# Altium project SmartHaloEE.PrjPcb (part 1 of 2)
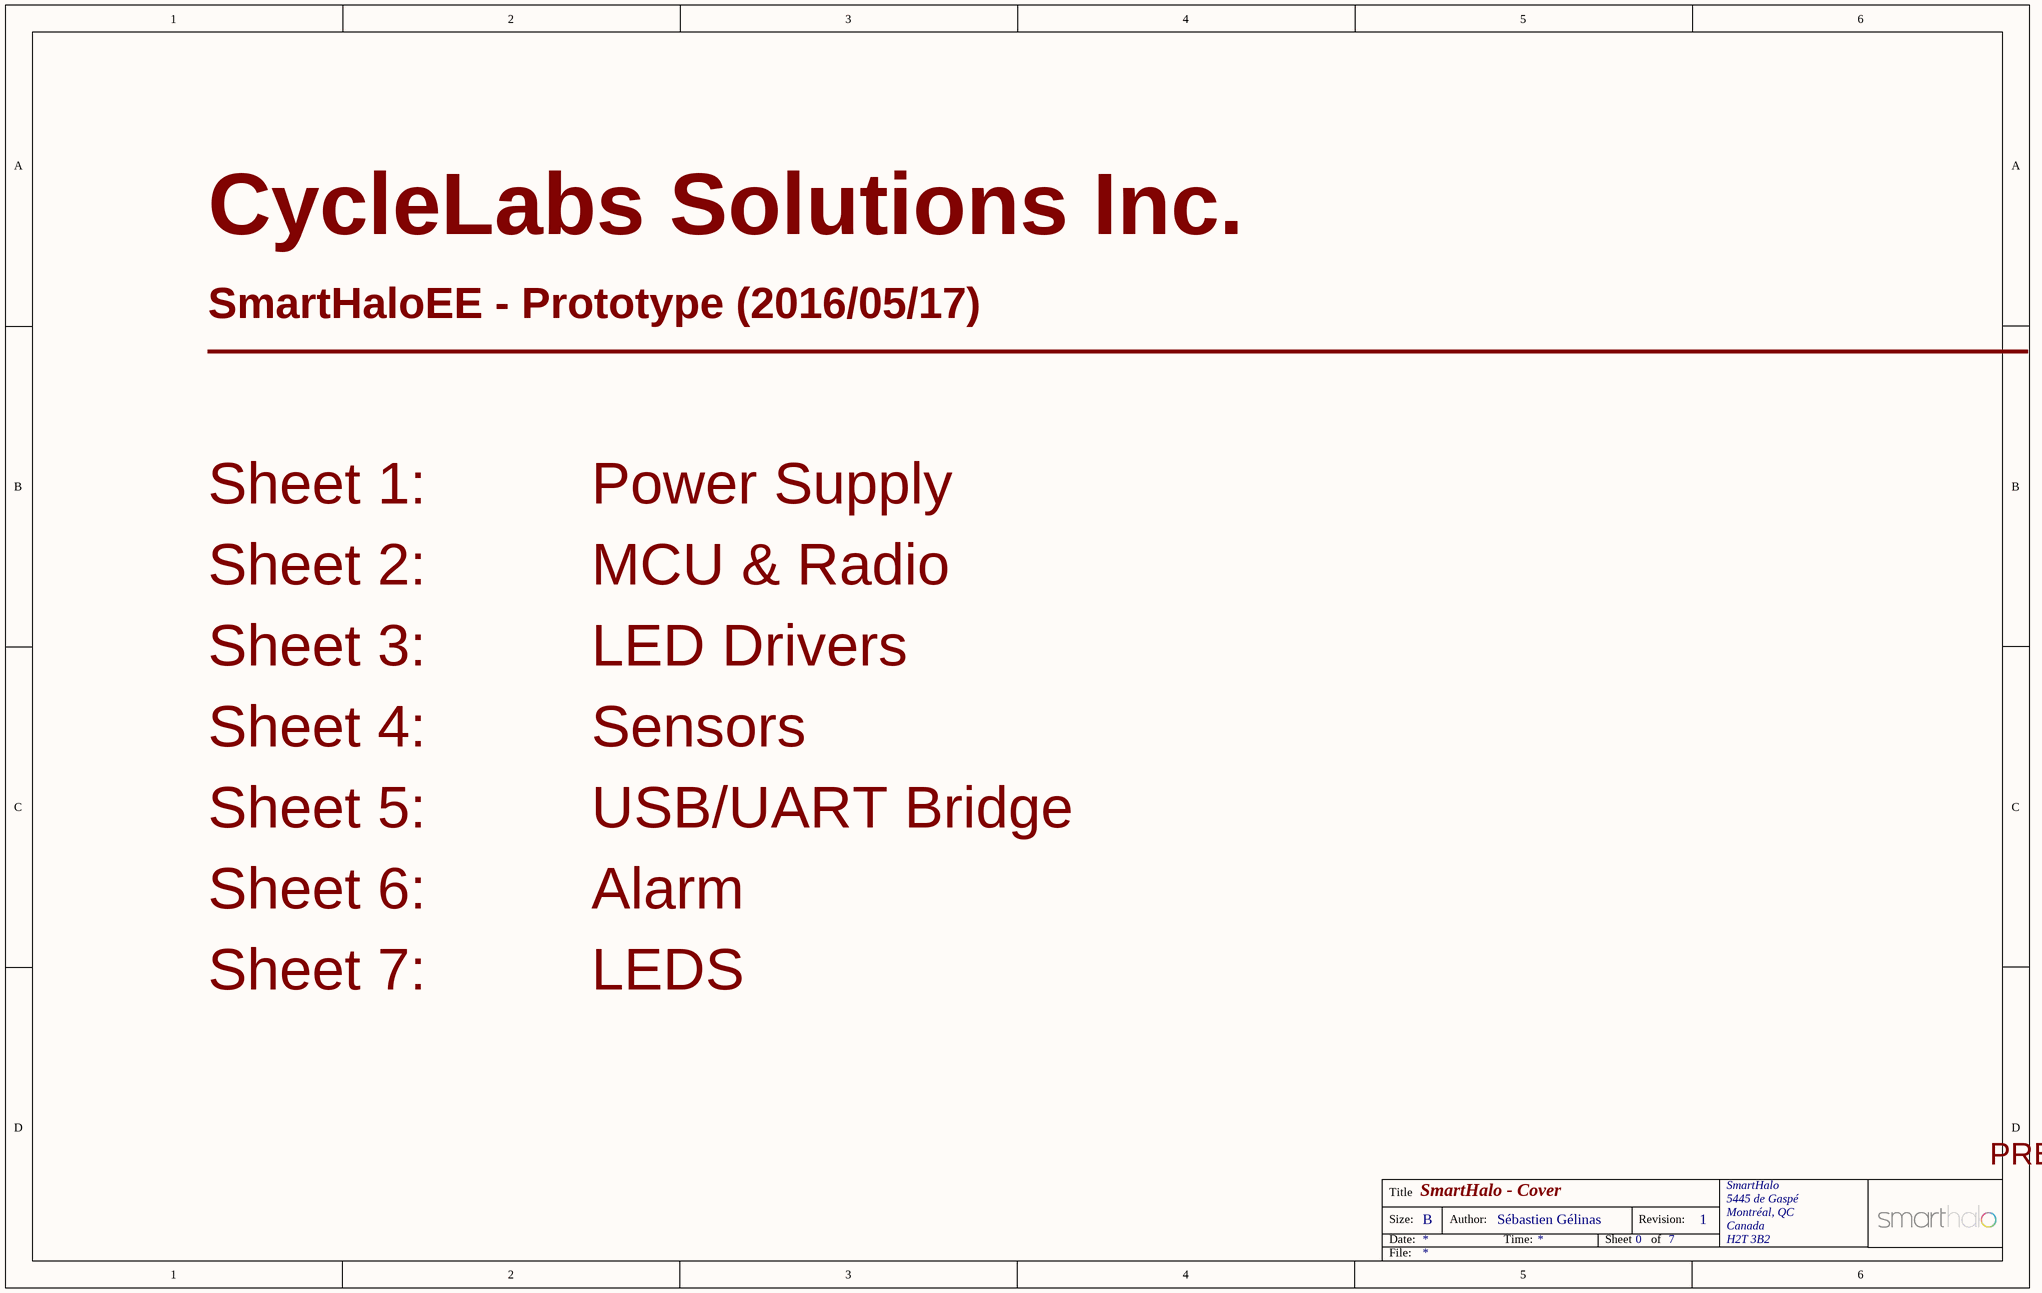
[diagram p0: 0_COVER.SchDoc]
ApprovedBy: Olivier Bourbonnais
8 sheets, 314 parts. Net scope: flat (ports and power ports of the same name join across sheets).
Board file: SmartHaloEE.PcbDoc
Sheets:
  0_COVER.SchDoc
  1_PWR.SchDoc
  2_BLE.SchDoc
  3_LEDDRIVERS.SchDoc
  4_SENSORS.SchDoc
  5_MISC.SchDoc
  6_ALARM.SchDoc
  7_LEDS.SchDoc

## Sheet 0_COVER.SchDoc: SmartHalo - Cover
size B; Author: Sébastien Gélinas; Organization: SmartHalo; Address1: 5445 de Gaspé; Address2: Montréal, QC; Address3: Canada; Address4: H2T 3B2; DocumentNumber: 1; Revision: 1; SheetNumber: 0; SheetTotal: 7

### Notes on the sheet
- CycleLabs Solutions Inc.
- SmartHaloEE - Prototype (2016/05/17)
- ________________________________________________________
- Sheet 1:          Power Supply
- Sheet 2:          MCU & Radio
- Sheet 3:          LED Drivers
- Sheet 4:          Sensors
- Sheet 5:          USB/UART Bridge
- Sheet 6:          Alarm
- Sheet 7:          LEDS
- PRELIMINARY: DO NOT USE FOR PRODUCTION
- Title
- Size:
- Date:
- B
- Author:
- Time:
- Sheet
- Revision:
- of
- File:

## Sheet 1_PWR.SchDoc: SmartHalo - Power Supply
size B; Author: Sébastien Gélinas; Organization: SmartHalo; Address1: 5445 de Gaspé; Address2: Montréal, QC; Address3: Canada; Address4: H2T 3B2; DocumentNumber: 1; Revision: 1; SheetNumber: 1; SheetTotal: 7
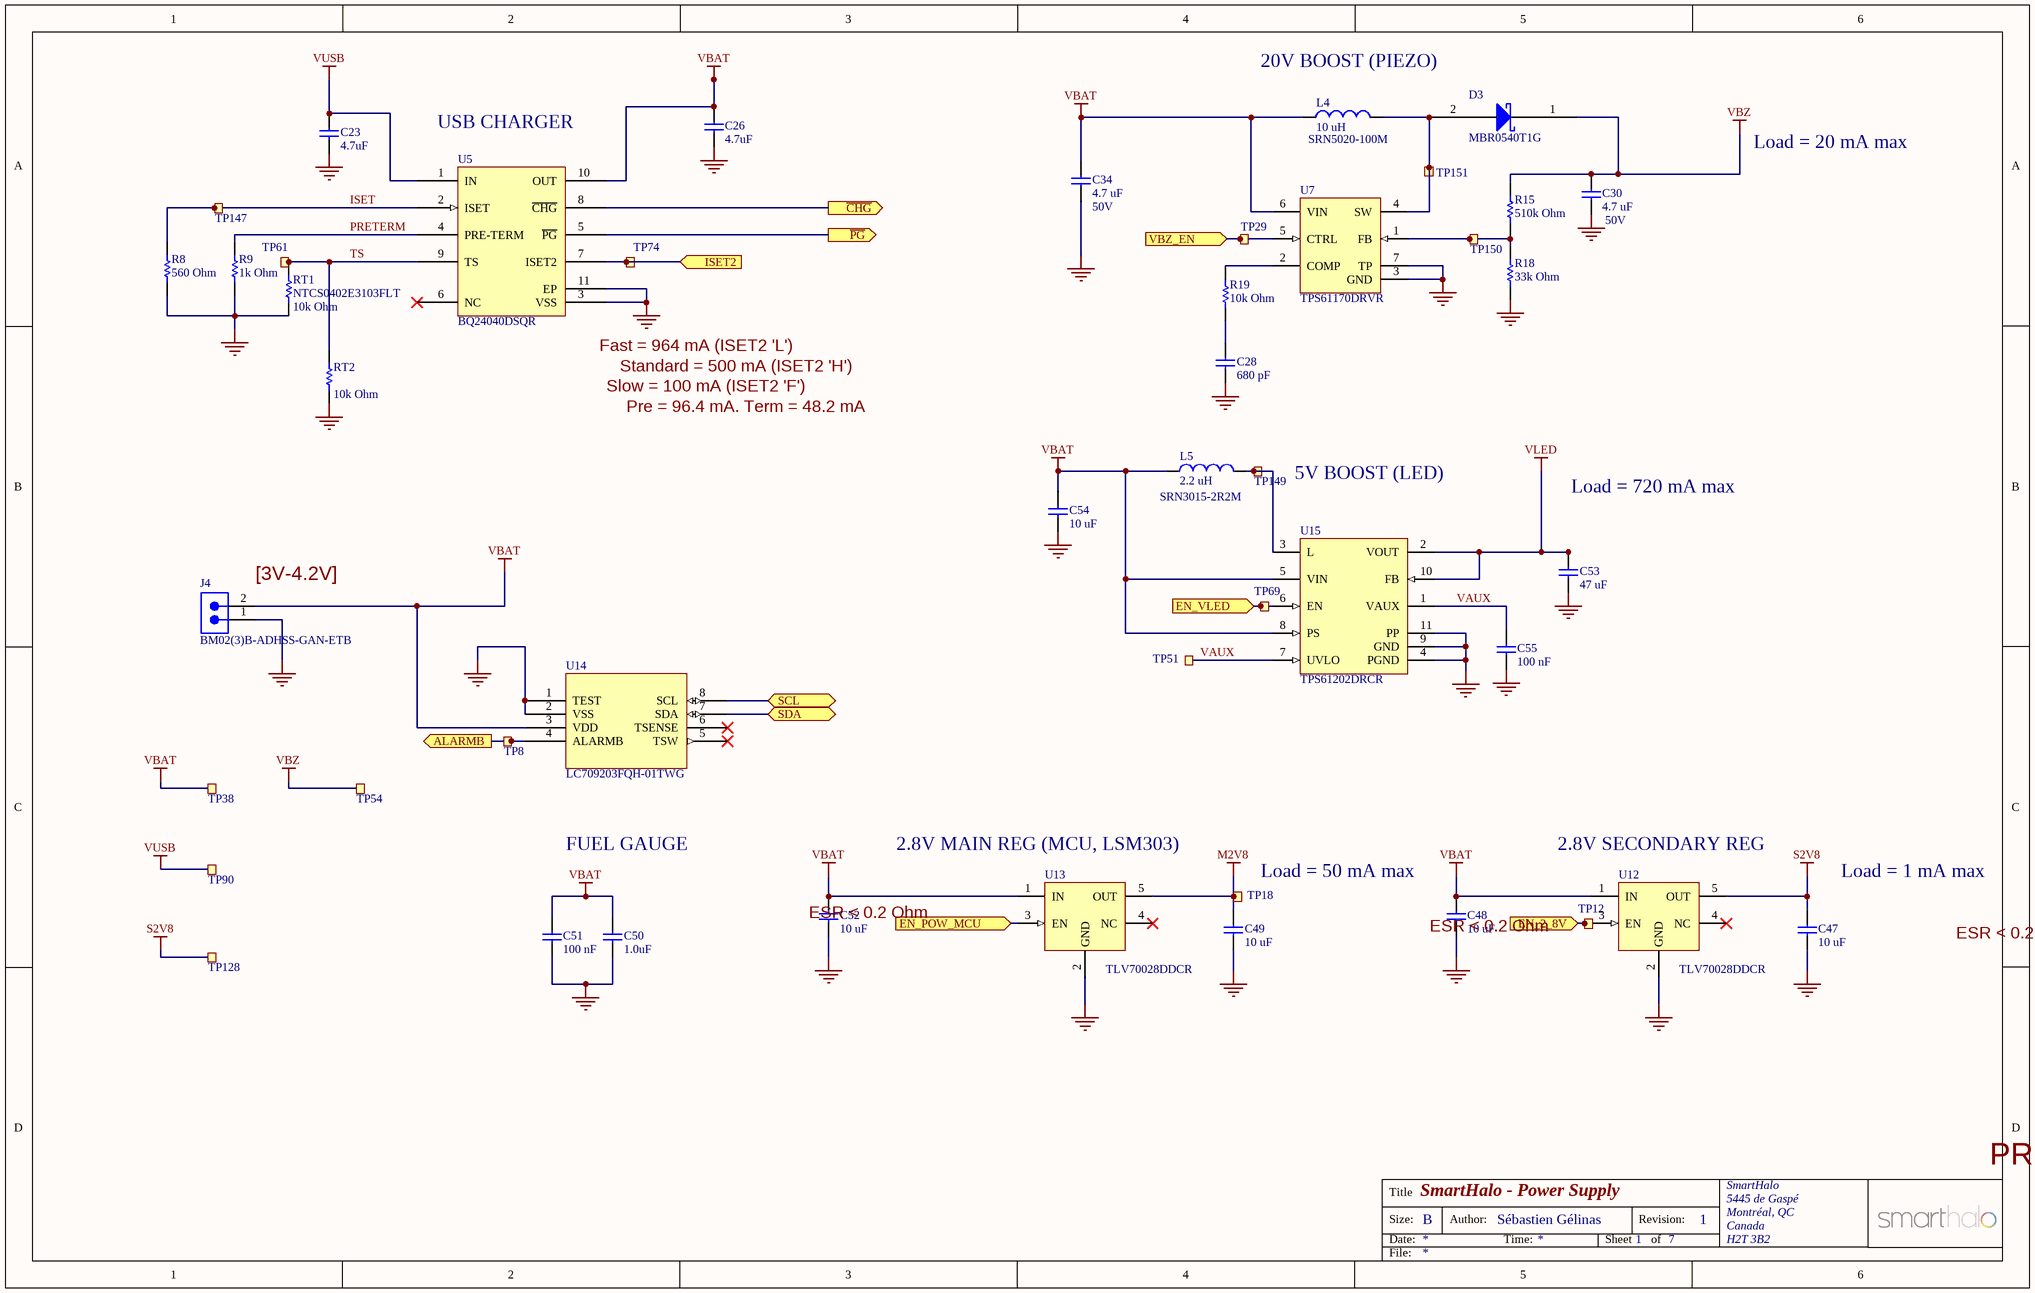
[diagram p1: 1_PWR.SchDoc]

### Parts
C23  4.7uF  [Varitron_CAP0603]
C26  4.7uF  [Varitron_CAP0603]
C28  680 pF  [Varitron_CAP0402]
C30  4.7 uF  Voltage Rating: 50V  [Varitron_CAP0805]
C34  4.7 uF  Voltage Rating: 50V  [Varitron_CAP0805]
C47  10 uF  [Varitron_CAP0805]
C48  10 uF  [Varitron_CAP0805]
C49  10 uF  [Varitron_CAP0805]
C50  1.0uF  [Varitron_CAP0603]
C51  100 nF  [Varitron_CAP0402]
C52  10 uF  [Varitron_CAP0805]
C53  47 uF  [Varitron_CAP1206]
C54  10 uF  [Varitron_CAP0805]
C55  100 nF  [Varitron_CAP0402]
D3  MBR0540T1G  [ONSC-SOD-123-2-425-04_V]
J4  BM02(3)B-ADHSS-GAN-ETB  [BM02(3)B-ADHSS-GAN-ETB]
L4  10 uH  [SRN5020-100M]
L5  2.2 uH  [SRN3015-2R2M]
R8  560 Ohm  [Varitron_RES0402]
R9  1k Ohm  [Varitron_RES0402]
R15  510k Ohm  [Varitron_RES0402]
R18  33k Ohm  [Varitron_RES0402]
R19  10k Ohm  [Varitron_RES0402]
RT1  NTCS0402E3103FLT  value 10k Ohm  [Varitron_RES0402]
RT2  value 10k Ohm  [THERMISTOR_TH]  (no BOM)
TP8  (no value)  [TESTPAD-TH-35mils]  (no BOM)
TP12  (no value)  [TESTPAD-TH-35mils]  (no BOM)
TP18  (no value)  [TESTPAD-TH-1_5mm]  (no BOM)
TP29  (no value)  [TESTPAD-TH-35mils]  (no BOM)
TP38  (no value)  [TESTPAD-TH-35mils]  (no BOM)
TP51  (no value)  [TESTPAD-TH-35mils]  (no BOM)
TP54  (no value)  [TESTPAD-TH-35mils]  (no BOM)
TP61  (no value)  [TESTPAD-TH-35mils]  (no BOM)
TP69  (no value)  [TESTPAD-TH-35mils]  (no BOM)
TP74  (no value)  [TESTPAD-TH-35mils]  (no BOM)
TP90  (no value)  [TESTPAD-TH-35mils]  (no BOM)
TP128  (no value)  [TESTPAD-TH-1_5mm]  (no BOM)
TP147  TP  [TESTPAD-TH-35mils]  (value not drawn)  (no BOM)
TP149  TP  [TESTPAD-TH-35mils]  (value not drawn)  (no BOM)
TP150  TP  [TESTPAD-TH-35mils]  (value not drawn)  (no BOM)
TP151  TP  [TESTPAD-TH-35mils]  (value not drawn)  (no BOM)
U5  BQ24040DSQR  [DSQ10-1500X900TP]
U7  TPS61170DRVR  [DRV6-1600X1000TP]
U12  TLV70028DDCR  [SOT23-5_N]
U13  TLV70028DDCR  [SOT23-5_N]
U14  LC709203FQH-01TWG  [WDFN8]
U15  TPS61202DRCR  [DRC10-2400X1650TP]

### Ports
ALARMB (out), EN_2_8V (in), EN_POW_MCU (in), EN_VLED (in), ISET2 (in), SCL (bidir), SDA (bidir), VBZ_EN (in), ~{CHG} (out), ~{PG} (out)

### Nets
GND: C23.2 C26.2 C28.2 C30.2 C34.2 C47.2 C48.2 C49.2 C50.2 C51.2 C52.2 C53.2 C54.2 C55.2 J4.0(ASSY) J4.1 R8.2 R9.2 R18.1 RT1.1 RT2.1 U5.3(VSS) U5.11(EP) U7.3(GND) U7.7(TP) U12.2(GND) U13.2(GND) U14.1(TEST) U14.2(VSS) U15.4(PGND) U15.9(GND) U15.11(PP)
M2V8: C49.1 TP18.1 U13.5(OUT)  [project net VDD_nRF]
S2V8: C47.1 TP128.1 U12.5(OUT)
VBAT: C26.1 C34.1 C48.1 C50.1 C51.1 C52.1 C54.1 J4.2 L4.1 L5.1 TP38.1 U5.10(OUT) U7.6(VIN) U12.1(IN) U13.1(IN) U14.3(VDD) U15.5(VIN) U15.8(PS)
VBZ: C30.1 D3.1(Cathode) R15.2 TP54.1
VLED: C53.1 U15.2(VOUT) U15.10(FB)
VUSB: C23.1 TP90.1 U5.1(IN)
ALARMB: TP8.1 U14.4(ALARMB) ; port ALARMB
~{CHG}: U5.8(~{CHG}) ; port ~{CHG}
EN_2_8V: TP12.1 U12.3(EN) ; port EN_2_8V
EN_POW_MCU: U13.3(EN) ; port EN_POW_MCU
EN_VLED: TP69.1 U15.6(EN) ; port EN_VLED
ISET: R8.1 TP147.1 U5.2(ISET)
ISET2: TP74.1 U5.7(ISET2) ; port ISET2
~{PG}: U5.5(~{PG}) ; port ~{PG}
PRETERM: R9.1 U5.4(PRE-TERM)
SCL: U14.8(SCL) ; port SCL
SDA: U14.7(SDA) ; port SDA
TS: RT1.2 RT2.2 TP61.1 U5.9(TS)
VAUX: C55.1 TP51.1 U15.1(VAUX) U15.7(UVLO)
VBZ_EN: TP29.1 U7.5(CTRL) ; port VBZ_EN
NetC28_1: C28.1 R19.2
NetD3_2: D3.2(Anode) L4.2 TP151.1 U7.4(SW)
NetL5_2: L5.2 TP149.1 U15.3(L)
NetR15_1: R15.1 R18.2 TP150.1 U7.1(FB)
NetR19_1: R19.1 U7.2(COMP)

Not connected (* = marked no-connect by the designer): U5 6(NC)*; U12 4(NC)*; U13 4(NC)*; U14 5(TSW)* 6(TSENSE)*

### Notes on the sheet
- 20V BOOST (PIEZO)
- (near U5) USB CHARGER
- Load = 20 mA max
- (near U5) Fast = 964 mA (ISET2 'L')
- Standard = 500 mA (ISET2 'H')
- Slow = 100 mA (ISET2 'F')
- (near RT2) Pre = 96.4 mA. Term = 48.2 mA
- 5V BOOST (LED)
- Load = 720 mA max
- (near J4) [3V-4.2V]
- FUEL GAUGE
- (near U13) 2.8V MAIN REG (MCU, LSM303)
- (near TP18) Load = 50 mA max
- (near U12) 2.8V SECONDARY REG
- Load = 1 mA max
- (near C52) ESR < 0.2 Ohm
- (near C48) ESR < 0.2 Ohm
- (near C47) ESR < 0.2 Ohm
- PRELIMINARY: DO NOT USE FOR PRODUCTION
- Title
- Size:
- Date:
- B
- Author:
- Time:
- Sheet
- Revision:
- of
- File:

### Library data of the parts
C23 C26 = Varitron_CAP0603: 4.7uF 10V X7R 10% 0603 (1608 Metric)  SMD; Case-EIA: 0603; Case-Metric: 1608; Tolerance: 10%; Technology: SMT; Temperature Coefficient: X7R; Voltage Rating: 10V; Value: 4.7uF
C28 = Varitron_CAP0402: 680 pF 10V X7R 10% 0402 (1005 Metric)  SMD; Case-EIA: 0402; Case-Metric: 1005; Tolerance: 10%; Technology: SMT; Temperature Coefficient: X7R; Voltage Rating: 10V; Value: 680 pF
C30 C34 = Varitron_CAP0805: 4.7 uF 50V X5R 10% 0805 (2012 Metric)  SMD; Case-EIA: 0805; Case-Metric: 2012; Tolerance: 10%; Technology: SMT; Temperature Coefficient: X5R; Value: 4.7 uF
C47-C49 C52 C54 = Varitron_CAP0805: 10 uF 10V X7R 10% 0805 (2012 Metric)  SMD; Case-EIA: 0805; Case-Metric: 2012; Tolerance: 10%; Technology: SMT; Temperature Coefficient: X7R; Voltage Rating: 10V; Value: 10 uF
C50 = Varitron_CAP0603: 1uF 10V X7R 10% 0603 (1608 Metric)  SMD; Case-EIA: 0603; Case-Metric: 1608; Tolerance: 10%; Technology: SMT; Temperature Coefficient: X7R; Voltage Rating: 10V; Value: 1.0uF
C51 C55 = Varitron_CAP0402: 100 nF 10V X7R 10% 0402 (1005 Metric)  SMD; Case-EIA: 0402; Case-Metric: 1005; Tolerance: 10%; Technology: SMT; Temperature Coefficient: X7R; Voltage Rating: 10V; Value: 100 nF
C53 = Varitron_CAP1206: 47 uF 10V X5R 10% 1206 (3216 Metric)  SMD; Case-EIA: 1206; Case-Metric: 3216; Tolerance: 10%; Technology: SMT; Temperature Coefficient: X5R; Voltage Rating: 10V; Value: 47 uF
D3 = MBR0540T1G: Schottky Power Rectifier, 2-Pin SOD-123, Pb-Free, Tape and Reel; Manufacturer: ON Semiconductor; Manufacturer Part Number: MBR0540T1G; Part Number: MBR0540T1G
J4 = BM02(3)B-ADHSS-GAN-ETB: Connector, 1.3 mm pitch; Manufacturer: JST; Manufacturer Part Number: BM02(3)B-ADHSS-GAN-ETB; Part Number: BM02(3)B-ADHSS-GAN-ETB
L4 = SRN5020-100M: Inductor, 10 uH, 20%, 144 mOhm DCR, 1.3A; Manufacturer: Bourns; Manufacturer Part Number: SRN5020-100M; Part Number: SRN5020-100M; Value: 10 uH; Tolerance: 20%; DCR: 144 mOhm; Saturation Current: 1.3A
L5 = SRN3015-2R2M: Inductor, 2.2 uH, 20%, 72 mOhm DCR, 1.65A; Manufacturer: Bourns; DCR: 72 mOhm; Manufacturer Part Number: SRN3015-2R2M; Part Number: SRN3015-2R2M; Value: 2.2 uH; Tolerance: 20%; Saturation Current: 1.65A
R8 = Varitron_RES0402: 560R 0.063W 5% 0402 (1005 Metric) SMD; Case-Metric: 1005; Case-EIA: 0402; Tolerance: 5%; Technology: SMT; Power: 0.063W; Value: 560 Ohm
R9 = Varitron_RES0402: 1K 0.063W 5%  0402 (1005 Metric)  SMD; Case-Metric: 1005; Case-EIA: 0402; Tolerance: 5%; Technology: SMT; Power: 0.063W; Value: 1k Ohm
R15 = Varitron_RES0402: 510K 0.063W 5% 0402 (1005 Metric)  SMD; Case-Metric: 1005; Case-EIA: 0402; Tolerance: 5%; Technology: SMT; Power: 0.063W; Value: 510k Ohm
R18 = Varitron_RES0402: 33K 0.063W 5%  0402 (1005 Metric)  SMD; Case-Metric: 1005; Case-EIA: 0402; Tolerance: 5%; Technology: SMT; Power: 0.063W; Value: 33k Ohm
R19 = Varitron_RES0402: 10K 0.063W 5% 0402 (1005 Metric)  SMD; Case-Metric: 1005; Case-EIA: 0402; Tolerance: 5%; Technology: SMT; Power: 0.063W; Value: 10k Ohm
RT1 = NTCS0402E3103FLT: Thermistor NTC 0402, R0 10k, 1%, B 3490, SMD; Manufacturer: Vishay; Case-Metric: 1005; Case-EIA: 0402; Beta: 3490; Tolerance: 1%; Technology: SMT; Part Number: NTCS0402E3103FLT; Manufacturer Part Number: NTCS0402E3103FLT
RT2 = THERMISTOR_TH: Thermistor NTC TH, R0 10k, 1%, B , TH; Tolerance: 1%; Technology: TH
TP8 TP12 TP29 TP38 TP51 TP54 TP61 TP69 TP74 TP90 = TESTPAD_TH_35mils: Testpoint, through hole, 35 mils; Value: TP
TP18 TP128 = TESTPAD_TH_1_5MM: Testpoint, through hole, 1.5mm; Value: TP
TP147 TP149-TP151 = TESTPAD_TH_35mils: Testpoint, through hole, 35 mils; Value: TP
U5 = BQ24040DSQR: 800 mA, Single-Input, Single Cell Li-Ion Battery Charger with Auto Start. Vovp=6.6 V, 3.5 V, -40 to 85 degC, 10-pin SON (DSQ), Green (RoHS & no Sb/Br); Manufacturer: Texas Instruments; Manufacturer Part Number: BQ24040DSQR; Part Number: BQ24040DSQR
U7 = TPS61170DRVR: Boost Voltage Converter with 3 to 18 V Input and 3 to 38 V Output, -40 to 85 degC, 6-Pin SON (DRC), Green (RoHS & no Sb/Br); Manufacturer: Texas Instruments; Part Number: TPS61170DRVR; Manufacturer Part Number: TPS61170DRVR
U12 U13 = TLV70028DDCR: Boost Voltage Converter with 3 to 18 V Input and 3 to 38 V Output, -40 to 85 degC, 6-Pin SON (DRC), Green (RoHS & no Sb/Br); Manufacturer: Texas Instruments; Part Number: TLV70028DDCR; Manufacturer Part Number: TLV70028DDCR
U14 = LC709203FQH-01TWG: Smart LiB Gauge, Battery Fuel Gauge LSI for 1-Cell Lithium-ion (Li+); Manufacturer: ON Semiconductor; Manufacturer Part Number: LC709203FQH-01TWG; Part Number: LC709203FQH-01TWG
U15 = TPS61202DRCR: Boost Voltage Converter with 0.3 to 5.5 V Input and 5 V Output, -40 to 85 degC, 10-Pin SON (DRC), Green (RoHS & no Sb/Br); Manufacturer: Texas Instruments; Part Number: TPS61202DRCR; Manufacturer Part Number: TPS61202DRCR

## Sheet 2_BLE.SchDoc: SmartHalo - Radio
size B; Author: Sébastien Gélinas; Organization: SmartHalo; Address1: 5445 de Gaspé; Address2: Montréal, QC; Address3: Canada; Address4: H2T 3B2; DocumentNumber: 4; Revision: 1; SheetNumber: 2; SheetTotal: 7
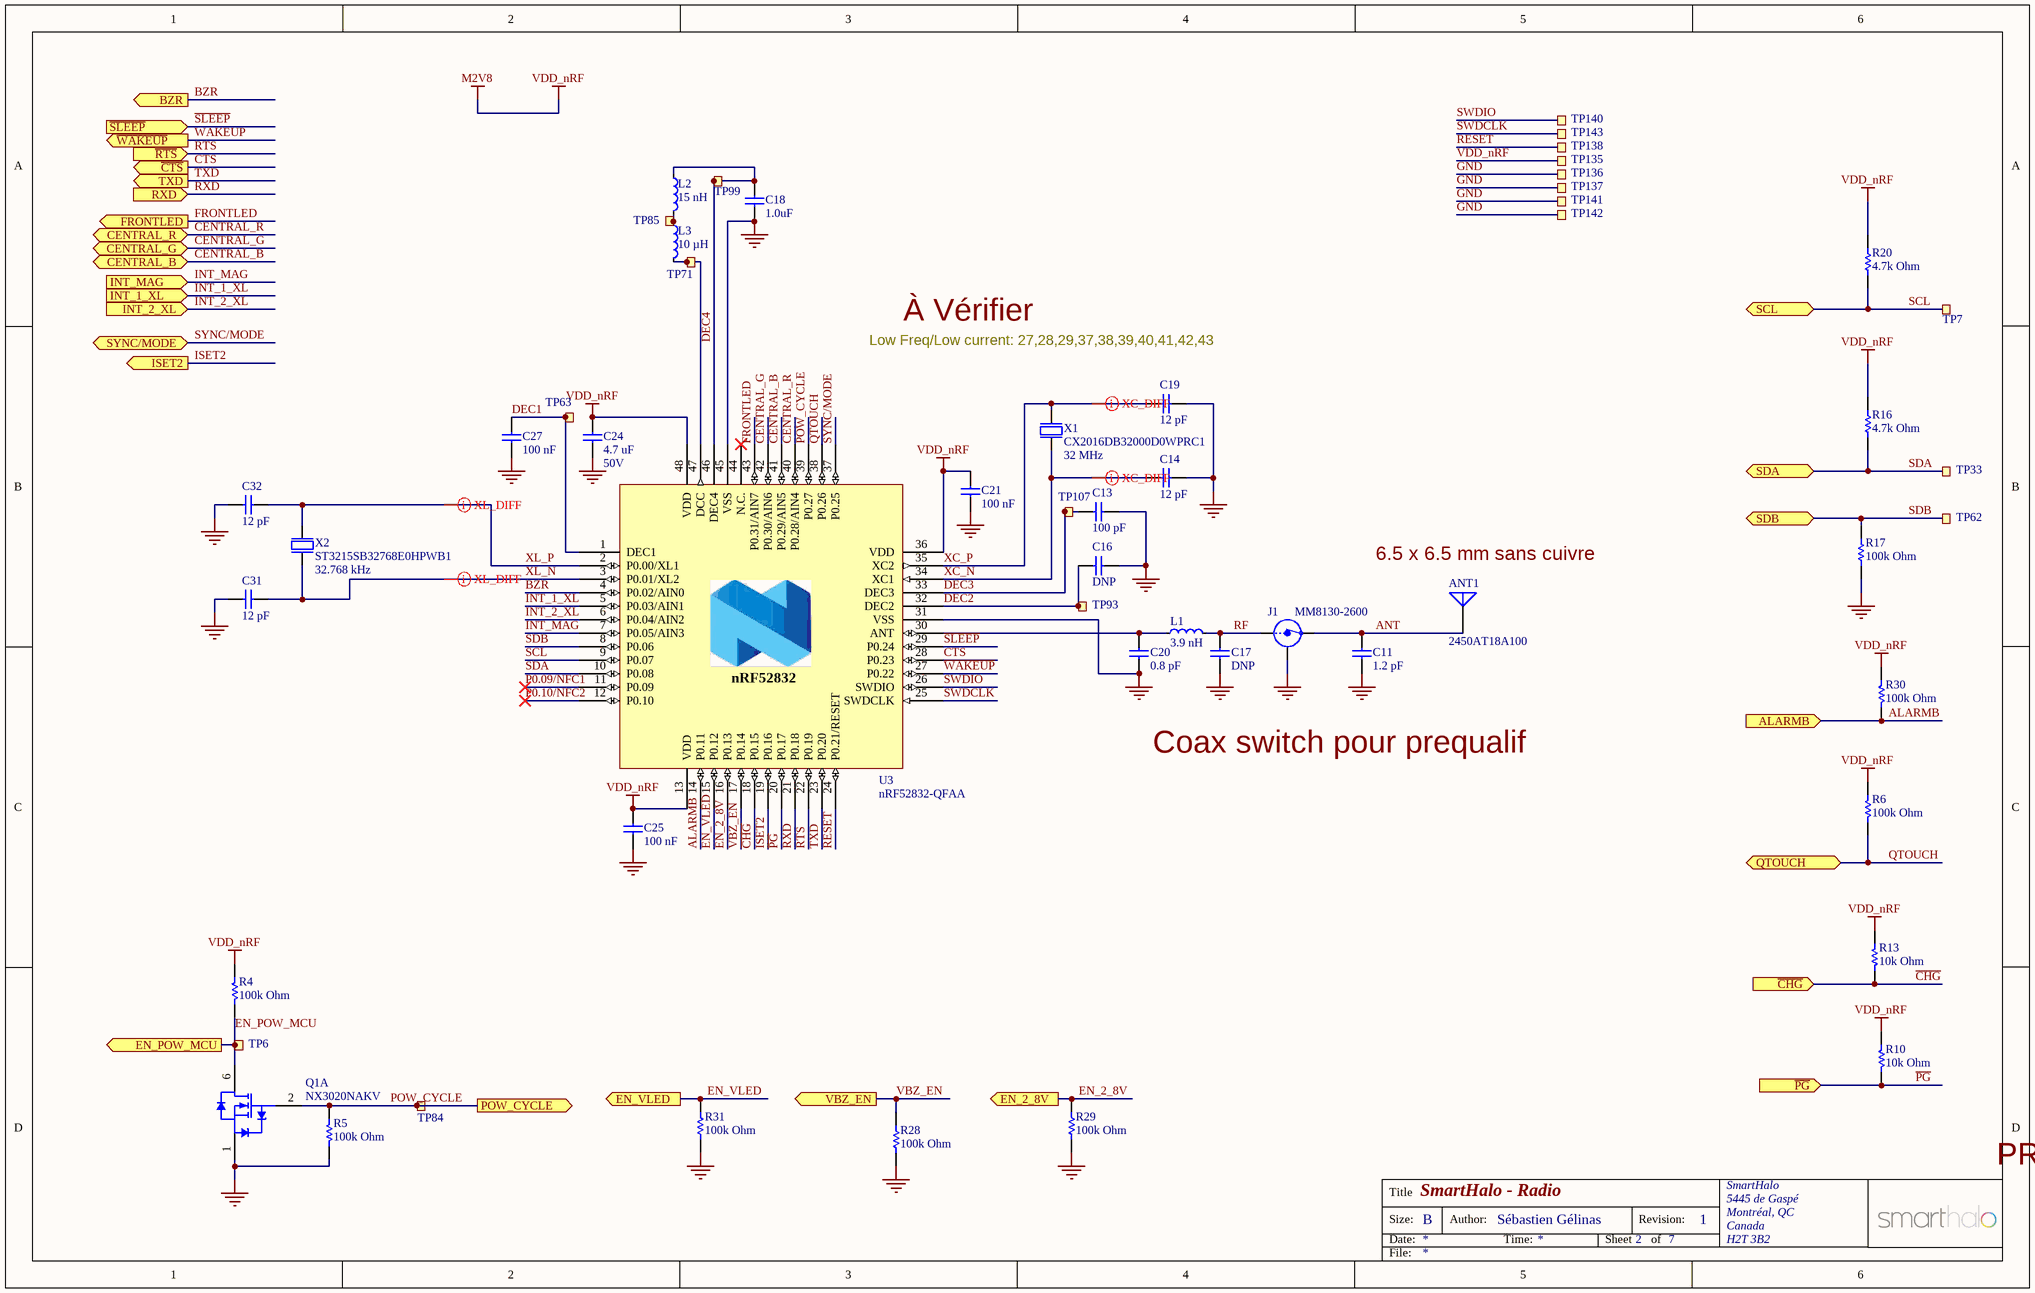
[diagram p2: 2_BLE.SchDoc]

### Parts
ANT1  2450AT18A100  [2450AT18A100]
C11  1.2 pF  [Varitron_CAP0402]
C13  100 pF  [Varitron_CAP0402]
C14  12 pF  [Varitron_CAP0402]
C16  DNP  [Varitron_CAP0402]  (no BOM)
C17  DNP  [Varitron_CAP0402]  (no BOM)
C18  1.0uF  [Varitron_CAP0603]
C19  12 pF  [Varitron_CAP0402]
C20  0.8 pF  [Varitron_CAP0402]
C21  100 nF  [Varitron_CAP0402]
C24  4.7 uF  Voltage Rating: 50V  [Varitron_CAP0805]
C25  100 nF  [Varitron_CAP0402]
C27  100 nF  [Varitron_CAP0402]
C31  12 pF  [Varitron_CAP0402]
C32  12 pF  [Varitron_CAP0402]
J1  MM8130-2600  [COAXIAL-SWF]
L1  3.9 nH  [Varitron_IND0402]
L2  15 nH  [Varitron_IND0402]
L3  10 µH  [Varitron_IND0603]
Q1  NX3020NAKV  [SOT666]  (part A of 2)
R4  100k Ohm  [Varitron_RES0402]
R5  100k Ohm  [Varitron_RES0402]
R6  100k Ohm  [Varitron_RES0402]
R10  10k Ohm  [Varitron_RES0402]
R13  10k Ohm  [Varitron_RES0402]
R16  4.7k Ohm  [Varitron_RES0402]
R17  100k Ohm  [Varitron_RES0402]
R20  4.7k Ohm  [Varitron_RES0402]
R28  100k Ohm  [Varitron_RES0402]
R29  100k Ohm  [Varitron_RES0402]
R30  100k Ohm  [Varitron_RES0402]
R31  100k Ohm  [Varitron_RES0402]
TP6  (no value)  [TESTPAD-TH-35mils]  (no BOM)
TP7  (no value)  [TESTPAD-TH-35mils]  (no BOM)
TP33  (no value)  [TESTPAD-TH-35mils]  (no BOM)
TP62  (no value)  [TESTPAD-TH-35mils]  (no BOM)
TP63  (no value)  [TESTPAD-TH-35mils]  (no BOM)
TP71  (no value)  [TESTPAD-TH-35mils]  (no BOM)
TP84  (no value)  [TESTPAD-TH-35mils]  (no BOM)
TP85  (no value)  [TESTPAD-TH-35mils]  (no BOM)
TP93  (no value)  [TESTPAD-TH-35mils]  (no BOM)
TP99  (no value)  [TESTPAD-TH-35mils]  (no BOM)
TP107  (no value)  [TESTPAD-TH-35mils]  (no BOM)
TP135  (no value)  [TESTPAD-TH-1_5mm]  (no BOM)
TP136  (no value)  [TESTPAD-TH-1_5mm]  (no BOM)
TP137  (no value)  [TESTPAD-TH-1_5mm]  (no BOM)
TP138  (no value)  [TESTPAD-TH-1_5mm]  (no BOM)
TP140  (no value)  [TESTPAD-TH-1_5mm]  (no BOM)
TP141  (no value)  [TESTPAD-TH-1_5mm]  (no BOM)
TP142  (no value)  [TESTPAD-TH-1_5mm]  (no BOM)
TP143  (no value)  [TESTPAD-TH-1_5mm]  (no BOM)
U3  nRF52832-QFAA  [QFN40P600X600X90-48N]
X1  CX2016DB32000D0WPRC1  Frequency: 32 MHz  [CRYSTAL_2016_4Pins]
X2  ST3215SB32768E0HPWB1  Frequency: 32.768 kHz  [CRYSTAL_3215_2Pins]

### Ports
ALARMB (in), BZR (out), CENTRAL_B, CENTRAL_G, CENTRAL_R, EN_2_8V (out), EN_POW_MCU (out), EN_VLED (out), FRONTLED (out), INT_1_XL (in), INT_2_XL (in), INT_MAG (in), ISET2 (out), POW_CYCLE (out), QTOUCH, RXD (in), SCL (bidir), SDA (bidir), SDB (bidir), SYNC/MODE, TXD (out), VBZ_EN (out), ~{CHG} (in), ~{CTS} (out), ~{PG} (in), ~{RTS} (in), ~{SLEEP} (in), ~{WAKEUP} (out)

### Nets
GND: C11.1 C13.2 C14.2 C16.2 C17.1 C18.2 C19.2 C20.1 C21.2 C24.2 C25.2 C27.2 C31.1 C32.1 J1.2(Shield) Q1.1(S1) R5.1 R17.1 R28.2 R29.1 R31.1 TP136.1 TP137.1 TP141.1 TP142.1 U3.31(VSS) U3.45(VSS) U3.49(GND) X1.2(GND) X1.4(GND)
VDD_nRF: C21.1 C24.1 C25.1 R4.2 R6.2 R10.2 R13.1 R16.2 R20.2 R30.2 TP135.1 U3.13(VDD) U3.36(VDD) U3.48(VDD)  [also labelled M2V8]
ALARMB: R30.1 U3.14(P0.11) ; port ALARMB
ANT: ANT1.1(Feed) C11.2 J1.3(OUT)
BZR: U3.4(P0.02/AIN0) ; port BZR
~{CHG}: R13.2 U3.18(P0.15) ; port ~{CHG}
CENTRAL_B: U3.41(P0.29/AIN5) ; port CENTRAL_B
CENTRAL_G: U3.42(P0.30/AIN6) ; port CENTRAL_G
CENTRAL_R: U3.40(P0.28/AIN4) ; port CENTRAL_R
CTS: U3.28(P0.23) ; port ~{CTS}
DEC1: C27.1 TP63.1 U3.1(DEC1)
DEC2: C16.1 TP93.1 U3.32(DEC2)
DEC3: C13.1 TP107.1 U3.33(DEC3)
DEC4: C18.1 L2.1 TP99.1 U3.46(DEC4)
EN_2_8V: R29.2 U3.16(P0.13) ; port EN_2_8V
EN_POW_MCU: Q1.6(D1) R4.1 TP6.1 ; port EN_POW_MCU
EN_VLED: R31.2 U3.15(P0.12) ; port EN_VLED
FRONTLED: U3.43(P0.31/AIN7) ; port FRONTLED
INT_1_XL: U3.5(P0.03/AIN1) ; port INT_1_XL
INT_2_XL: U3.6(P0.04/AIN2) ; port INT_2_XL
INT_MAG: U3.7(P0.05/AIN3) ; port INT_MAG
ISET2: U3.19(P0.16) ; port ISET2
P0.09/NFC1: U3.11(P0.09)
P0.10/NFC2: U3.12(P0.10)
~{PG}: R10.1 U3.20(P0.17) ; port ~{PG}
POW_CYCLE: Q1.2(G1) R5.2 TP84.1 U3.39(P0.27) ; port POW_CYCLE
QTOUCH: R6.1 U3.38(P0.26) ; port QTOUCH
RESET: TP138.1 U3.24(P0.21/RESET)
RF: C17.2 J1.1(IN) L1.2
RTS: U3.22(P0.19) ; port ~{RTS}
RXD: U3.21(P0.18) ; port RXD
~{SLEEP}: U3.29(P0.24) ; port ~{SLEEP}
SCL: R20.1 TP7.1 U3.9(P0.07) ; port SCL
SDA: R16.1 TP33.1 U3.10(P0.08) ; port SDA
SDB: R17.2 TP62.1 U3.8(P0.06) ; port SDB
SWDCLK: TP143.1 U3.25(SWDCLK)
SWDIO: TP140.1 U3.26(SWDIO)
SYNC/MODE: U3.37(P0.25) ; port SYNC/MODE
TXD: U3.23(P0.20) ; port TXD
VBZ_EN: R28.1 U3.17(P0.14) ; port VBZ_EN
~{WAKEUP}: U3.27(P0.22) ; port ~{WAKEUP}
XC_N: C14.1 U3.34(XC1) X1.3(out)
XC_P: C19.1 U3.35(XC2) X1.1(inp)
XL_N: C31.2 U3.3(P0.01/XL2) X2.2
XL_P: C32.2 U3.2(P0.00/XL1) X2.1
NetC20_2: C20.2 L1.1 U3.30(ANT)
NetL2_2: L2.2 L3.1 TP85.1
NetL3_2: L3.2 TP71.1 U3.47(DCC)

Not connected (* = marked no-connect by the designer): U3 44(N.C.)*

### Layout directives
differential pair: XC_N, XC_P, XL_N, XL_P

### Notes on the sheet
- Low Freq/Low current: 27,28,29,37,38,39,40,41,42,43
- À Vérifier
- (near ANT1) 6.5 x 6.5 mm sans cuivre
- Coax switch pour prequalif
- PRELIMINARY: DO NOT USE FOR PRODUCTION
- Title
- Size:
- Date:
- B
- Author:
- Time:
- Sheet
- Revision:
- of
- File:
- (in symbol nRF52832-QFAA) nRF52832

### Library data of the parts
ANT1 = 2450AT18A100: CHIP ANTENNA, 2.45GHz, 3.2 x 1.6 x 1.3 mm body; Manufacturer: Johanson Technology; Part Number: 2450AT18A100; Manufacturer Part Number: 2450AT18A100
C11 = Varitron_CAP0402: 1.2 pF 50V NP0 ±0.1 pF 0402 (1005 Metric)  SMD; Case-EIA: 0402; Case-Metric: 1005; Tolerance: ±0.1 pF; Technology: SMT; Temperature Coefficient: NP0; Voltage Rating: 50V; Value: 1.2 pF
C13 = Varitron_CAP0402: 100 pF 50V NP0 5% 0402 (1005 Metric)  SMD; Case-EIA: 0402; Case-Metric: 1005; Tolerance: 5%; Technology: SMT; Temperature Coefficient: NP0; Voltage Rating: 50V; Value: 100 pF
C14 C19 C31 C32 = Varitron_CAP0402: 12 pF 50V NP0 2% 0402 (1005 Metric)  SMD; Case-EIA: 0402; Case-Metric: 1005; Tolerance: 2%; Technology: SMT; Temperature Coefficient: NP0; Voltage Rating: 50V; Value: 12 pF
C16 C17 = Varitron_CAP0402: C pF V TEMP TOL% 0402 (1005 Metric)  SMD; Case-EIA: 0402; Case-Metric: 1005; Tolerance: TOL; Value: C pF; Technology: SMT; Voltage Rating: V
C18 = Varitron_CAP0603: 1uF 16V X7R 10% 0603 (1608 Metric)  SMD; Case-EIA: 0603; Case-Metric: 1608; Tolerance: 10%; Technology: SMT; Temperature Coefficient: X7R; Voltage Rating: 16V; Value: 1.0uF
C20 = Varitron_CAP0402: 0.8 pF 50V NP0 5% 0402 (1005 Metric)  SMD; Case-EIA: 0402; Case-Metric: 1005; Tolerance: 5%; Technology: SMT; Temperature Coefficient: NP0; Voltage Rating: 50V; Value: 0.8 pF
C21 C25 C27 = Varitron_CAP0402: 100 nF 16V X7R 10% 0402 (1005 Metric)  SMD; Case-EIA: 0402; Case-Metric: 1005; Tolerance: 10%; Technology: SMT; Temperature Coefficient: X7R; Voltage Rating: 16V; Value: 100 nF
C24 = Varitron_CAP0805: as C30 on sheet 1_PWR; Tolerance: 10%; Technology: SMT; Temperature Coefficient: X5R; Value: 4.7 uF
J1 = MM8130-2600: Coaxial Connector with Switch; Manufacturer: Murata; 2nd source part number: 81-MM8130-2600RA2; Artikkelnr Noca: 55029011; Artikkelnr Simpro: N.A.; Part Number: MM8130-2600; Manufacturer Part Number: MM8130-2600; Datasheet: http://www.murata.com/products/catalog/pdf/o33e.pdf; LatestRevisionDate: 2014-04-24; Pin Count: 3; Publisher: Nordic Semiconductor; Published: 2014-04-24; Value: MM8130-2600; Note: *; Supplier: Digi-Key; Supplier part number: 490-4981-1-ND; 2nd source Supplier: Mouser; Footprint Doc: COAXIAL-SWF
L1 = Varitron_IND0402: 3.9 nH ±0.1 nH, 170 mA, 0402 (1005 Metric)  SMD; Manufacturer: Murata; Manufacturer Part Number: LQP15MN3N9B02D; Case-EIA: 0402; Case-Metric: 1005; Tolerance: ±0.1 nH; SRF: MHz; DCR: Ohm; Technology: SMT; Part Number: LQP15MN3N9B02D; Value: 3.9 nH
L2 = Varitron_IND0402: 15 nH 5%, 320 mA, 0402 (1005 Metric)  SMD; Manufacturer: Taiyo Yuden; Manufacturer Part Number: HK100515NJ-T; Case-EIA: 0402; Case-Metric: 1005; SRF: MHz; DCR: Ohm; Tolerance: 5%; Technology: SMT; Part Number: HK100515NJ-T; Value: 15 nH
L3 = Varitron_IND0603: 10 µH 10%, 80 mA, 0603 (1608 Metric)  SMD; Manufacturer: Taiyo Yuden; Manufacturer Part Number: LBMF1608T100K; Case-EIA: 0603; Case-Metric: 1608; SRF: MHz; DCR: Ohm; Tolerance: 10%; Technology: SMT; Part Number: LBMF1608T100K; Value: 10 µH
Q1 = NX3020NAKV: 30 V, 200 mA dual N-channel Trench MOSFET; Manufacturer: NXP Semiconductors; Manufacturer Part Number: NX3020NAKV; Part Number: NX3020NAKV
R4-R6 R17 R28-R31 = Varitron_RES0402: 100K 0.063W 5% 0402 (1005 Metric)  SMD; Case-Metric: 1005; Case-EIA: 0402; Tolerance: 5%; Technology: SMT; Power: 0.063W; Value: 100k Ohm
R10 R13 = Varitron_RES0402: as R19 on sheet 1_PWR; Tolerance: 5%; Technology: SMT; Power: 0.063W; Value: 10k Ohm
R16 R20 = Varitron_RES0402: 4K7 0.063W 5%  0402 (1005 Metric)  SMD; Case-Metric: 1005; Case-EIA: 0402; Tolerance: 5%; Technology: SMT; Power: 0.063W; Value: 4.7k Ohm
TP6 TP7 TP33 TP62 TP63 TP71 TP84 TP85 TP93 TP99 TP107 = TESTPAD_TH_35mils: as TP8 on sheet 1_PWR
TP135-TP138 TP140-TP143 = TESTPAD_TH_1_5MM: as TP18 on sheet 1_PWR
U3 = nRF52832-QFAA: Multi-protocol Bluetooth Low Energy and 2.4GHz proprietary system-on-chip; Manufacturer: Nordic Semiconductor; Artikkelnr Noca: N.A.; Part Number: nRF52832-QFAA; Manufacturer Part Number: nRF52832-QFAA; Datasheet: *; LatestRevisionDate: 2014-11-26; Pin Count: 48; Publisher: Nordic Semiconductor; Published: 2014-11-26; Value: nRF52832-QFAA; Note: *; Supplier: Nordic Semiconductor; Supplier part number: *; 2nd source Supplier: *; 2nd source part number: *; Footprint Doc: QFN-48; Artikkelnr Simpro: N.A.
X1 = CX2016DB32000D0WPRC1: XTAL 32 MHz, 8pF, 3.2 x 1.5 mm, ±20 ppm Tol, ±200 ppm Drift; Manufacturer: AVX/Kyocera; Frequency Drift: ±40 ppm; Manufacturer Part Number: CX2016DB32000D0WPRC1; Part Number: CX2016DB32000D0WPRC1; Frequency Tolerance: ±40 ppm; Load Capacitance: 8 pF
X2 = ST3215SB32768E0HPWB1: XTAL 32.768 kHz, 9pF, 3.2 x 1.5 mm, ±20 ppm Tol, ±200 ppm Drift; Manufacturer: AVX/Kyocera; Frequency Tolerance: ±20 ppm; Frequency Drift: ±200 ppm; Manufacturer Part Number: ST3215SB32768E0HPWB1; Part Number: ST3215SB32768E0HPWB1; Load Capacitance: 9 pF

## Sheet 3_LEDDRIVERS.SchDoc: SmartHalo - Led (Drivers)
size B; Author: Sébastien Gélinas; Organization: SmartHalo; Address1: 5445 de Gaspé; Address2: Montréal, QC; Address3: Canada; Address4: H2T 3B2; Revision: 1; SheetNumber: 3; SheetTotal: 7
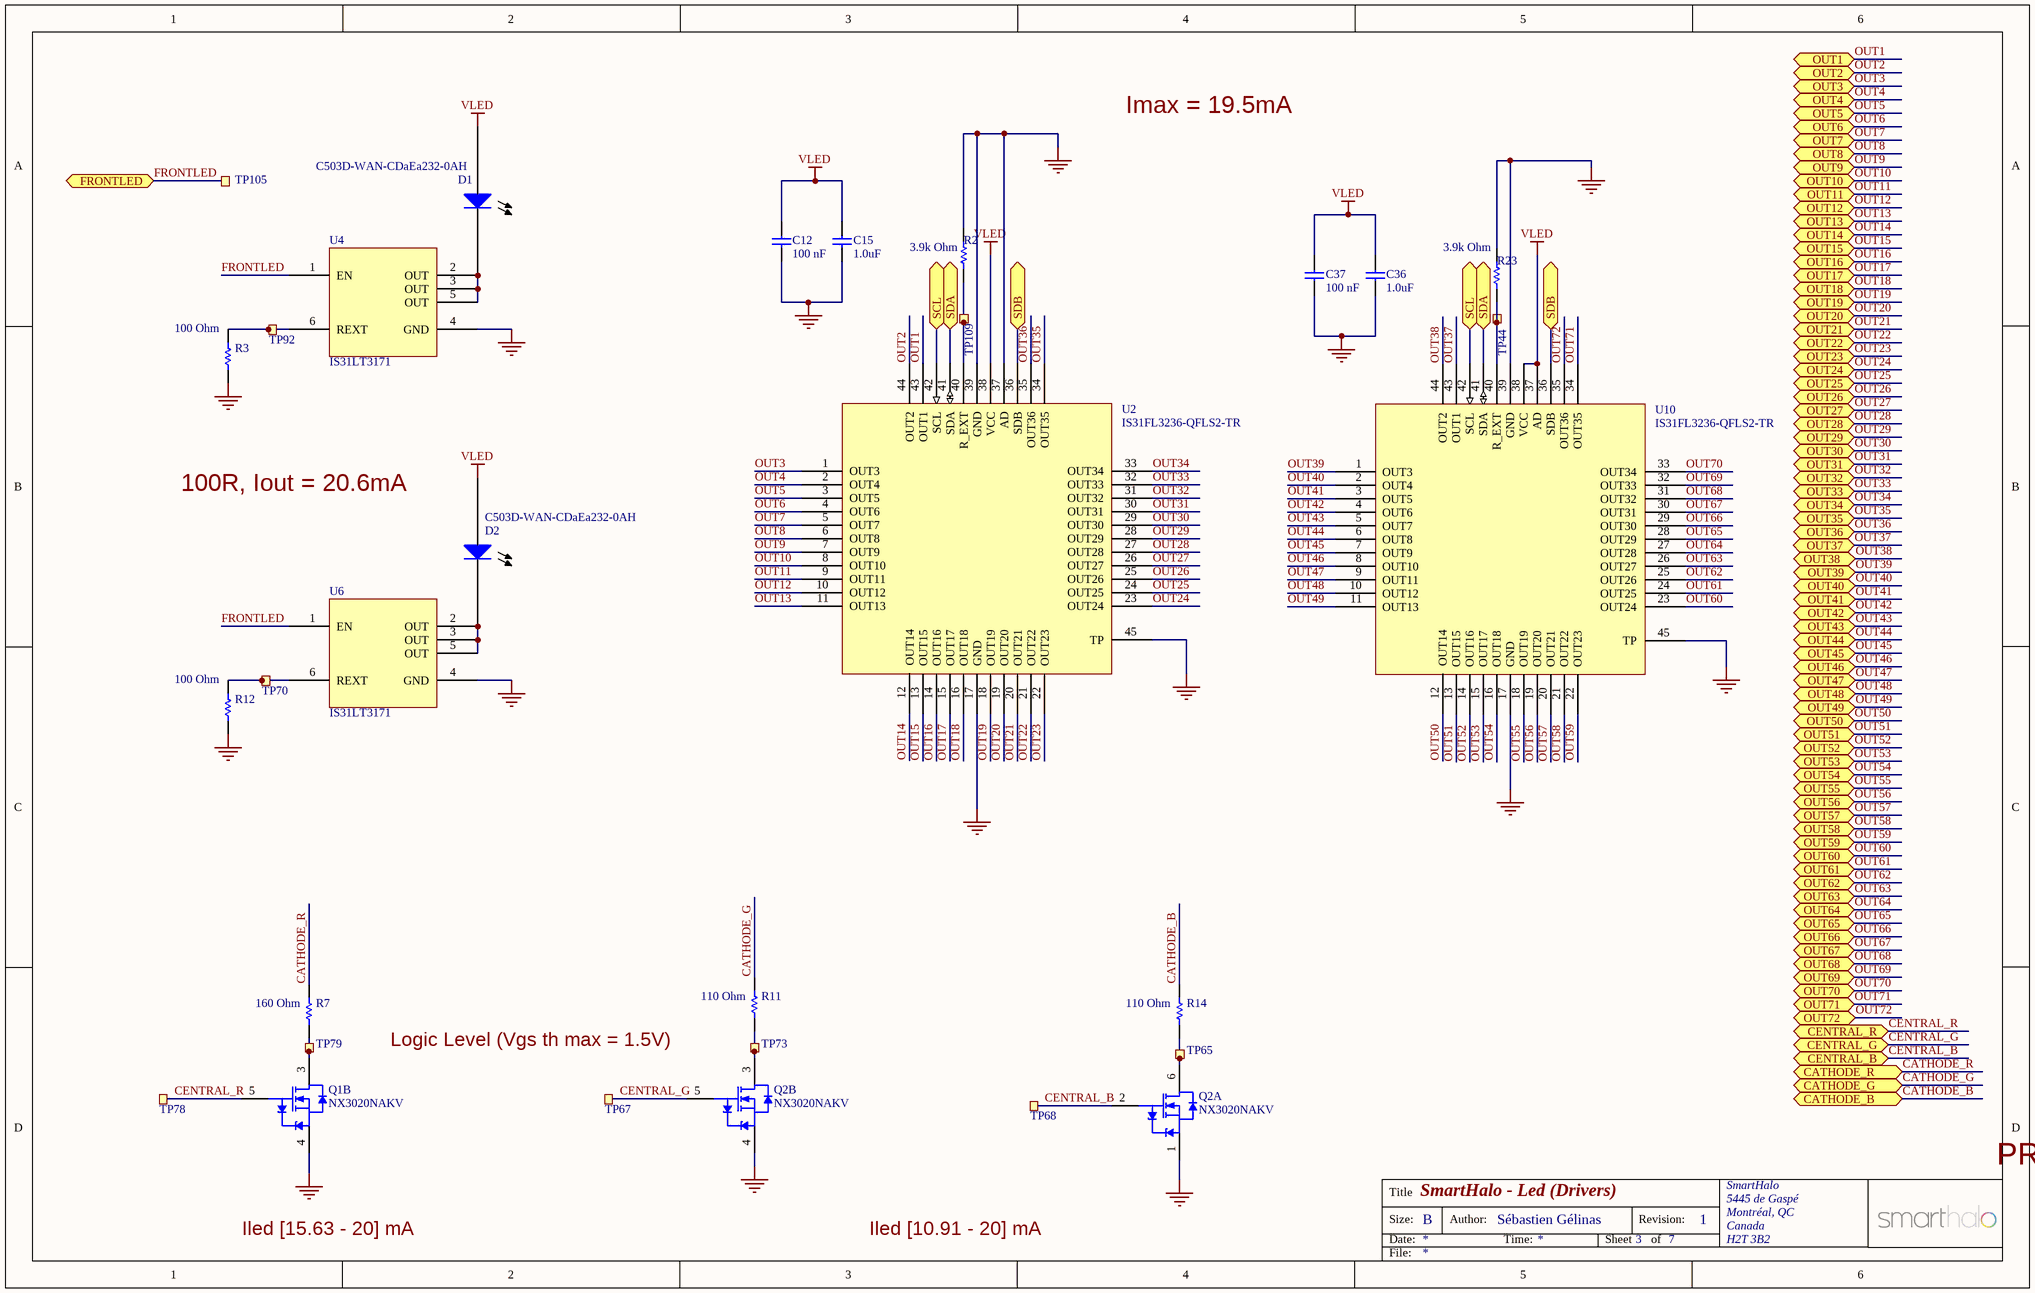
[diagram p3: 3_LEDDRIVERS.SchDoc]

### Parts
C12  100 nF  [Varitron_CAP0402]
C15  1.0uF  [Varitron_CAP0603]
C36  1.0uF  [Varitron_CAP0603]
C37  100 nF  [Varitron_CAP0402]
D1  C503D-WAN-CDaEa232-0AH  [FRONTLED_PADS]
D2  C503D-WAN-CDaEa232-0AH  [FRONTLED_PADS]
Q1  NX3020NAKV  [SOT666]  (part B of 2)
Q2  NX3020NAKV  [SOT666]  (parts A,B of 2)
R2  3.9k Ohm  [Varitron_RES0402]
R3  100 Ohm  [Varitron_RES0402]
R7  160 Ohm  [Varitron_RES0402]
R11  110 Ohm  [Varitron_RES0402]
R12  100 Ohm  [Varitron_RES0402]
R14  110 Ohm  [Varitron_RES0402]
R23  3.9k Ohm  [Varitron_RES0402]
TP44  (no value)  [TESTPAD-TH-35mils]  (no BOM)
TP65  (no value)  [TESTPAD-TH-35mils]  (no BOM)
TP67  (no value)  [TESTPAD-TH-35mils]  (no BOM)
TP68  (no value)  [TESTPAD-TH-35mils]  (no BOM)
TP70  (no value)  [TESTPAD-TH-35mils]  (no BOM)
TP73  (no value)  [TESTPAD-TH-35mils]  (no BOM)
TP78  (no value)  [TESTPAD-TH-35mils]  (no BOM)
TP79  (no value)  [TESTPAD-TH-35mils]  (no BOM)
TP92  (no value)  [TESTPAD-TH-35mils]  (no BOM)
TP105  (no value)  [TESTPAD-TH-35mils]  (no BOM)
TP109  (no value)  [TESTPAD-TH-35mils]  (no BOM)
U2  IS31FL3236-QFLS2-TR  [QFN-44]
U4  IS31LT3171  [SOT23-6]
U6  IS31LT3171  [SOT23-6]
U10  IS31FL3236-QFLS2-TR  [QFN-44]

### Ports
CATHODE_B, CATHODE_G, CATHODE_R, CENTRAL_B, CENTRAL_G, CENTRAL_R, FRONTLED, OUT1, OUT2, OUT3, OUT4, OUT5, OUT6, OUT7, OUT8, OUT9, OUT10, OUT11, OUT12, OUT13, OUT14, OUT15, OUT16, OUT17, OUT18, OUT19, OUT20, OUT21, OUT22, OUT23, OUT24, OUT25, OUT26, OUT27, OUT28, OUT29, OUT30, OUT31, OUT32, OUT33, OUT34, OUT35, OUT36, OUT37, OUT38, OUT39, OUT40, OUT41, OUT42, OUT43, OUT44, OUT45, OUT46, OUT47, OUT48, OUT49, OUT50, OUT51, OUT52, OUT53, OUT54, OUT55, OUT56, OUT57, OUT58, OUT59, OUT60, OUT61, OUT62, OUT63, OUT64, OUT65, OUT66, OUT67, OUT68, OUT69, OUT70, OUT71, OUT72, SCL (bidir), SDA (bidir), SDB (bidir)

### Nets
GND: C12.2 C15.2 C36.2 C37.2 Q1.4(S2) Q2.1(S1) Q2.4(S2) R2.2 R3.1 R12.1 R23.2 U2.17(GND) U2.37(AD) U2.39(GND) U2.45(TP) U4.4(GND) U6.4(GND) U10.17(GND) U10.39(GND) U10.45(TP)
VLED: C12.1 C15.1 C36.1 C37.1 D1.1(Anode) D2.1(Anode) U2.38(VCC) U10.37(AD) U10.38(VCC)
CATHODE_B: R14.2 ; port CATHODE_B
CATHODE_G: R11.2 ; port CATHODE_G
CATHODE_R: R7.2 ; port CATHODE_R
CENTRAL_B: Q2.2(G1) TP68.1 ; port CENTRAL_B
CENTRAL_G: Q2.5(G2) TP67.1 ; port CENTRAL_G
CENTRAL_R: Q1.5(G2) TP78.1 ; port CENTRAL_R
FRONTLED: TP105.1 U4.1(EN) U6.1(EN) ; port FRONTLED
OUT1: U2.43(OUT1) ; port OUT1
OUT2: U2.44(OUT2) ; port OUT2
OUT3: U2.1(OUT3) ; port OUT3
OUT4: U2.2(OUT4) ; port OUT4
OUT5: U2.3(OUT5) ; port OUT5
OUT6: U2.4(OUT6) ; port OUT6
OUT7: U2.5(OUT7) ; port OUT7
OUT8: U2.6(OUT8) ; port OUT8
OUT9: U2.7(OUT9) ; port OUT9
OUT10: U2.8(OUT10) ; port OUT10
OUT11: U2.9(OUT11) ; port OUT11
OUT12: U2.10(OUT12) ; port OUT12
OUT13: U2.11(OUT13) ; port OUT13
OUT14: U2.12(OUT14) ; port OUT14
OUT15: U2.13(OUT15) ; port OUT15
OUT16: U2.14(OUT16) ; port OUT16
OUT17: U2.15(OUT17) ; port OUT17
OUT18: U2.16(OUT18) ; port OUT18
OUT19: U2.18(OUT19) ; port OUT19
OUT20: U2.19(OUT20) ; port OUT20
OUT21: U2.20(OUT21) ; port OUT21
OUT22: U2.21(OUT22) ; port OUT22
OUT23: U2.22(OUT23) ; port OUT23
OUT24: U2.23(OUT24) ; port OUT24
OUT25: U2.24(OUT25) ; port OUT25
OUT26: U2.25(OUT26) ; port OUT26
OUT27: U2.26(OUT27) ; port OUT27
OUT28: U2.27(OUT28) ; port OUT28
OUT29: U2.28(OUT29) ; port OUT29
OUT30: U2.29(OUT30) ; port OUT30
OUT31: U2.30(OUT31) ; port OUT31
OUT32: U2.31(OUT32) ; port OUT32
OUT33: U2.32(OUT33) ; port OUT33
OUT34: U2.33(OUT34) ; port OUT34
OUT35: U2.34(OUT35) ; port OUT35
OUT36: U2.35(OUT36) ; port OUT36
OUT37: U10.43(OUT1) ; port OUT37
OUT38: U10.44(OUT2) ; port OUT38
OUT39: U10.1(OUT3) ; port OUT39
OUT40: U10.2(OUT4) ; port OUT40
OUT41: U10.3(OUT5) ; port OUT41
OUT42: U10.4(OUT6) ; port OUT42
OUT43: U10.5(OUT7) ; port OUT43
OUT44: U10.6(OUT8) ; port OUT44
OUT45: U10.7(OUT9) ; port OUT45
OUT46: U10.8(OUT10) ; port OUT46
OUT47: U10.9(OUT11) ; port OUT47
OUT48: U10.10(OUT12) ; port OUT48
OUT49: U10.11(OUT13) ; port OUT49
OUT50: U10.12(OUT14) ; port OUT50
OUT51: U10.13(OUT15) ; port OUT51
OUT52: U10.14(OUT16) ; port OUT52
OUT53: U10.15(OUT17) ; port OUT53
OUT54: U10.16(OUT18) ; port OUT54
OUT55: U10.18(OUT19) ; port OUT55
OUT56: U10.19(OUT20) ; port OUT56
OUT57: U10.20(OUT21) ; port OUT57
OUT58: U10.21(OUT22) ; port OUT58
OUT59: U10.22(OUT23) ; port OUT59
OUT60: U10.23(OUT24) ; port OUT60
OUT61: U10.24(OUT25) ; port OUT61
OUT62: U10.25(OUT26) ; port OUT62
OUT63: U10.26(OUT27) ; port OUT63
OUT64: U10.27(OUT28) ; port OUT64
OUT65: U10.28(OUT29) ; port OUT65
OUT66: U10.29(OUT30) ; port OUT66
OUT67: U10.30(OUT31) ; port OUT67
OUT68: U10.31(OUT32) ; port OUT68
OUT69: U10.32(OUT33) ; port OUT69
OUT70: U10.33(OUT34) ; port OUT70
OUT71: U10.34(OUT35) ; port OUT71
OUT72: U10.35(OUT36) ; port OUT72
SCL: U2.42(SCL) U10.42(SCL) ; port SCL
SDA: U2.41(SDA) U10.41(SDA) ; port SDA
SDB: U2.36(SDB) U10.36(SDB) ; port SDB
NetD1_2: D1.2(Cathode) U4.2(OUT) U4.3(OUT) U4.5(OUT)
NetD2_2: D2.2(Cathode) U6.2(OUT) U6.3(OUT) U6.5(OUT)
NetQ1_3: Q1.3(D2) R7.1 TP79.1
NetQ2_3: Q2.3(D2) R11.1 TP73.1
NetQ2_6: Q2.6(D1) R14.1 TP65.1
NetR2_1: R2.1 TP109.1 U2.40(R_EXT)
NetR3_2: R3.2 TP92.1 U4.6(REXT)
NetR12_2: R12.2 TP70.1 U6.6(REXT)
NetR23_1: R23.1 TP44.1 U10.40(R_EXT)

### Notes on the sheet
- Imax = 19.5mA
- 100R, Iout = 20.6mA
- Logic Level (Vgs th max = 1.5V)
- PRELIMINARY: DO NOT USE FOR PRODUCTION
- Iled [15.63 - 20] mA
- Iled [10.91 - 20] mA
- Title
- Size:
- Date:
- B
- Author:
- Time:
- Sheet
- Revision:
- of
- File:

### Library data of the parts
C12 C37 = Varitron_CAP0402: as C51 on sheet 1_PWR; Tolerance: 10%; Technology: SMT; Temperature Coefficient: X7R; Voltage Rating: 10V; Value: 100 nF
C15 C36 = Varitron_CAP0603: as C50 on sheet 1_PWR; Tolerance: 10%; Technology: SMT; Temperature Coefficient: X7R; Voltage Rating: 10V; Value: 1.0uF
D1 D2 = C503D-WAN-CDaEa232-0AH: Cree 5mm Round LED C503D-WAN-CDaEa232-0AH; pin to pad: A>1 C>2; Manufacturer: Cree; Manufacturer Part Number: C503D-WAN-CDaEa232-0AH; Part Number: C503D-WAN-CDaEa232-0AH
Q1 Q2 = NX3020NAKV: as Q1 on sheet 2_BLE; Manufacturer Part Number: NX3020NAKV; Part Number: NX3020NAKV
R2 R23 = Varitron_RES0402: 3K9 0.063W 5%  0402 (1005 Metric)  SMD; Case-Metric: 1005; Case-EIA: 0402; Tolerance: 5%; Technology: SMT; Power: 0.063W; Value: 3.9k Ohm
R3 R12 = Varitron_RES0402: 100R 0.1W 5% 0402 (1005 Metric)  SMD; Case-Metric: 1005; Case-EIA: 0402; Tolerance: 5%; Technology: SMT; Power: 0.1W; Value: 100 Ohm
R7 = Varitron_RES0402: 160R 0.1W 5% 0402 (1005 Metric)  SMD; Case-Metric: 1005; Case-EIA: 0402; Tolerance: 5%; Technology: SMT; Power: 0.1W; Value: 160 Ohm
R11 R14 = Varitron_RES0402: 110R 0.1W 5% 0402 (1005 Metric)  SMD; Case-Metric: 1005; Case-EIA: 0402; Tolerance: 5%; Technology: SMT; Power: 0.1W; Value: 110 Ohm
TP44 TP65 TP67 TP68 TP70 TP73 TP78 TP79 TP92 TP105 TP109 = TESTPAD_TH_35mils: as TP8 on sheet 1_PWR
U2 U10 = IS31FL3236-QFLS2-TR: IC 36 CHANNELS LED DRIVER; Manufacturer: ISSI; Manufacturer Part Number: IS31FL3236-QFLS2-TR; Part Number: IS31FL3236-QFLS2-TR
U4 U6 = IS31LT3171: 10-TO-150MA CONSTANT-CURRENT LED DRIVER; Manufacturer: ISSI; Manufacturer Part Number: IS31LT3171; Part Number: IS31LT3171

## Sheet 4_SENSORS.SchDoc: SmartHalo - Sensors
size B; Author: Sébastien Gélinas; Organization: SmartHalo; Address1: 5445 de Gaspé; Address2: Montréal, QC; Address3: Canada; Address4: H2T 3B2; DocumentNumber: 2; Revision: 1; SheetNumber: 4; SheetTotal: 7
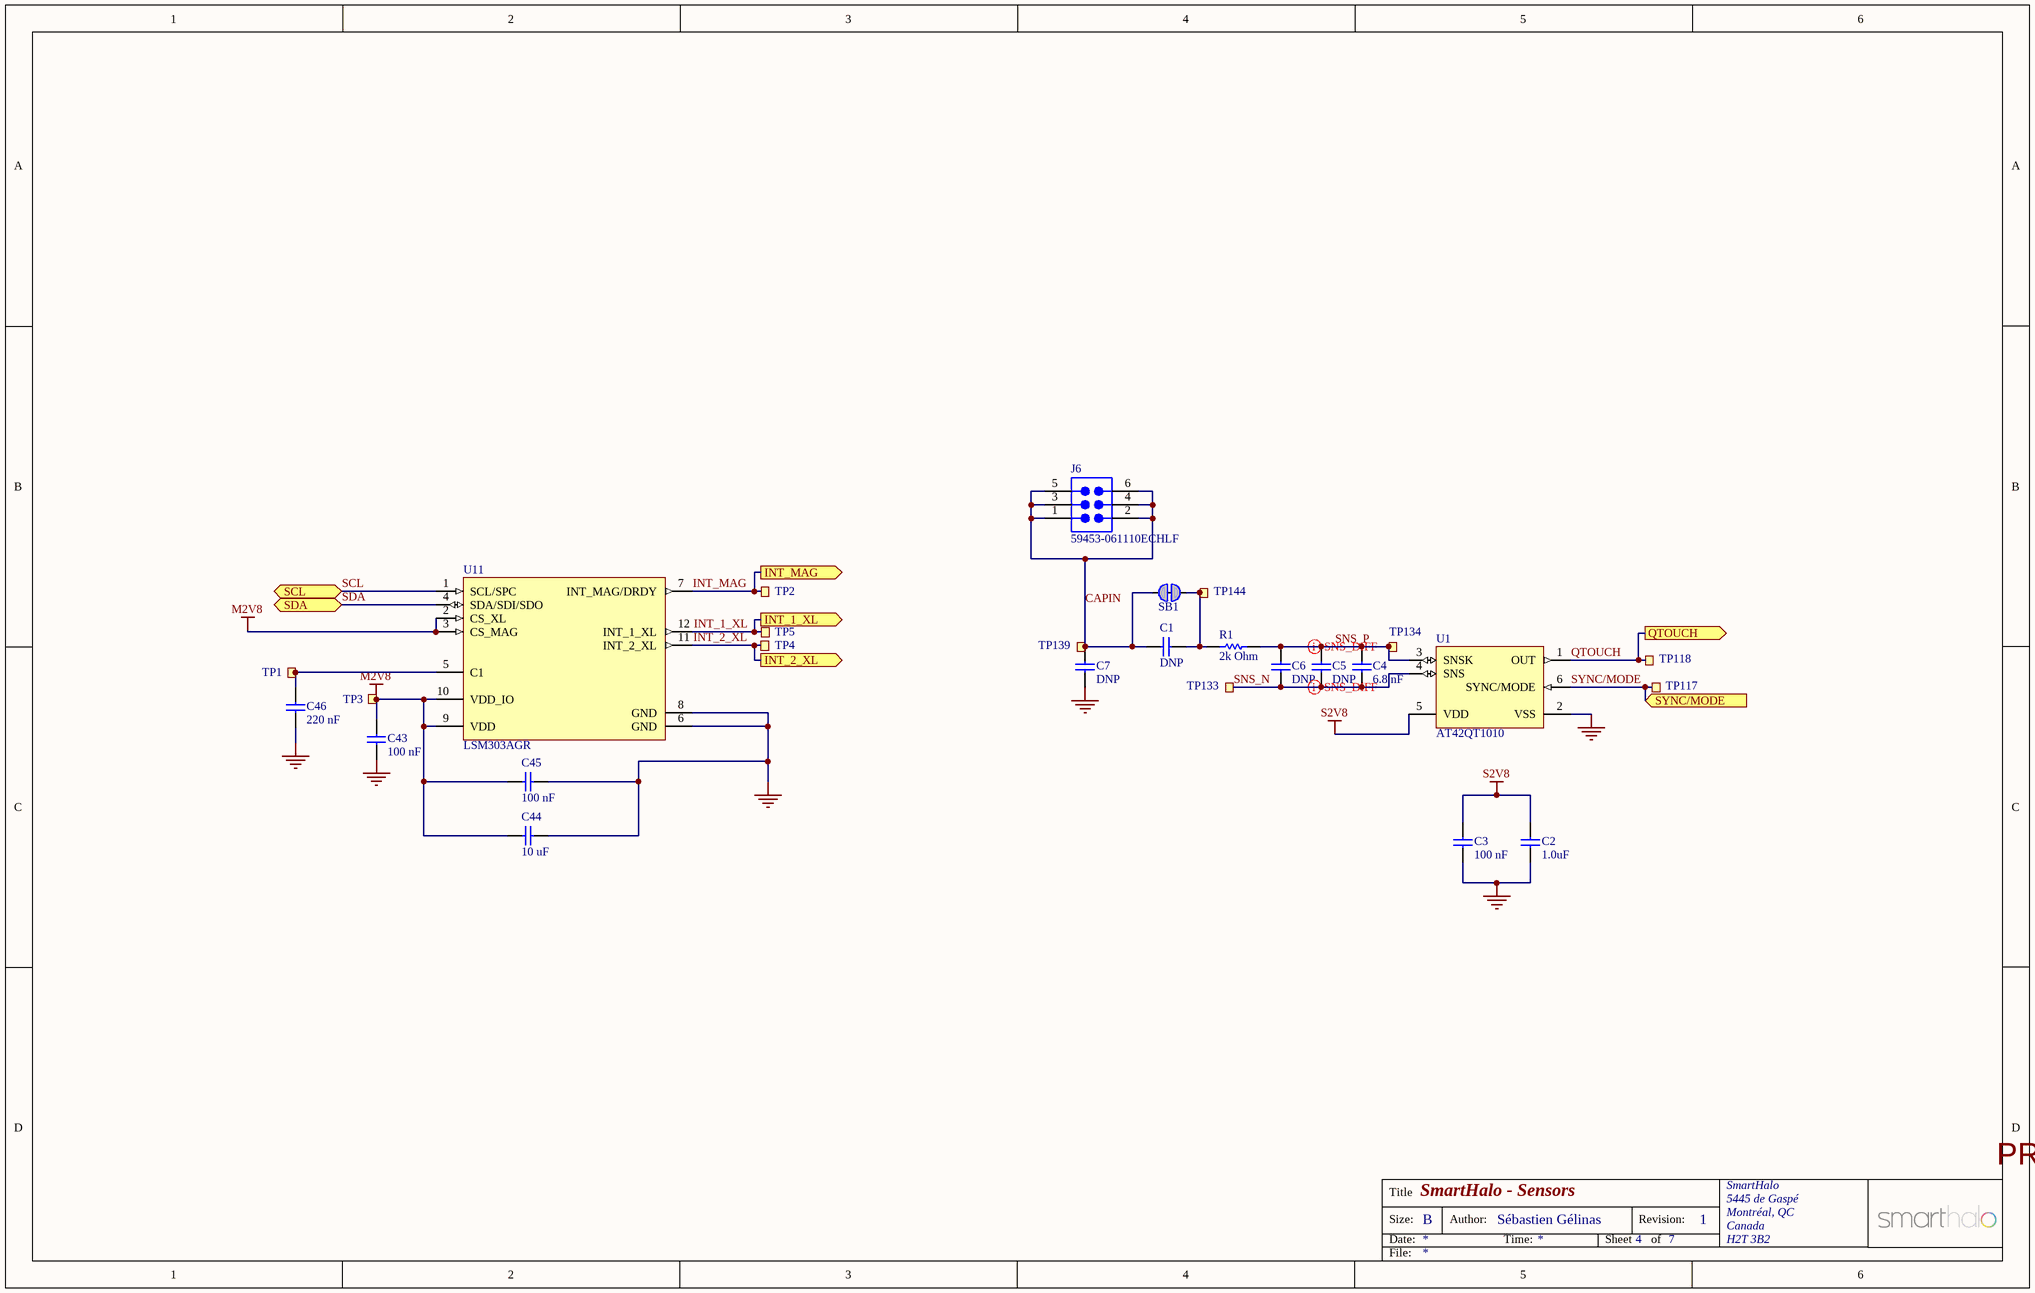
[diagram p4: 4_SENSORS.SchDoc]

### Parts
C1  DNP  [Varitron_CAP0402]  (no BOM)
C2  1.0uF  [Varitron_CAP0603]
C3  100 nF  [Varitron_CAP0402]
C4  6.8 nF  [Varitron_CAP0402]
C5  DNP  [Varitron_CAP0402]  (no BOM)
C6  DNP  [Varitron_CAP0402]  (no BOM)
C7  DNP  [Varitron_CAP0402]  (no BOM)
C43  100 nF  [Varitron_CAP0402]
C44  10 uF  [Varitron_CAP0805]
C45  100 nF  [Varitron_CAP0402]
C46  220 nF  [Varitron_CAP0402]
J6  59453-061110ECHLF  [59453061110ECHLF]
R1  2k Ohm  [Varitron_RES0402]
SB1  Solderbridge  [Solderbridge_Shorted]  (value not drawn)  (net tie, no BOM)
TP1  (no value)  [TESTPAD-TH-35mils]  (no BOM)
TP2  (no value)  [TESTPAD-TH-35mils]  (no BOM)
TP3  (no value)  [TESTPAD-TH-35mils]  (no BOM)
TP4  (no value)  [TESTPAD-TH-35mils]  (no BOM)
TP5  (no value)  [TESTPAD-TH-35mils]  (no BOM)
TP117  (no value)  [TESTPAD-TH-35mils]  (no BOM)
TP118  (no value)  [TESTPAD-TH-1_5mm]  (no BOM)
TP133  (no value)  [TESTPAD-TH-35mils]  (no BOM)
TP134  (no value)  [TESTPAD-TH-35mils]  (no BOM)
TP139  (no value)  [TESTPAD-TH-35mils]  (no BOM)
TP144  (no value)  [TESTPAD-TH-35mils]  (no BOM)
U1  AT42QT1010  [6ST1_N]
U11  LSM303AGR  [LGA12-2X2X1_N]

### Ports
INT_1_XL (out), INT_2_XL (out), INT_MAG (out), QTOUCH (out), SCL (bidir), SDA (bidir), SYNC/MODE (in)

### Nets
GND: C2.2 C3.2 C7.2 C43.2 C44.2 C45.2 C46.2 J6.0(ASSY) U1.2(VSS) U11.6(GND) U11.8(GND)
M2V8: C43.1 C44.1 C45.1 TP3.1 U11.2(CS_XL) U11.3(CS_MAG) U11.9(VDD) U11.10(VDD_IO)  [project net VDD_nRF]
S2V8: C2.1 C3.1 U1.5(VDD)
CAPIN: C1.1 C7.1 J6.1 J6.2 J6.3 J6.4 J6.5 J6.6 SB1.2 TP139.1
INT_1_XL: TP5.1 U11.12(INT_1_XL) ; port INT_1_XL
INT_2_XL: TP4.1 U11.11(INT_2_XL) ; port INT_2_XL
INT_MAG: TP2.1 U11.7(INT_MAG/DRDY) ; port INT_MAG
QTOUCH: TP118.1 U1.1(OUT) ; port QTOUCH
SCL: U11.1(SCL/SPC) ; port SCL
SDA: U11.4(SDA/SDI/SDO) ; port SDA
SNS_N: C4.2 C5.2 C6.2 TP133.1 U1.4(SNS)
SNS_P: C4.1 C5.1 C6.1 R1.1 TP134.1 U1.3(SNSK)
SYNC/MODE: TP117.1 U1.6(SYNC/MODE) ; port SYNC/MODE
NetC1_2: C1.2 R1.2 SB1.1 TP144.1
NetC46_1: C46.1 TP1.1 U11.5(C1)

### Layout directives
differential pair: SNS_N, SNS_P

### Notes on the sheet
- PRELIMINARY: DO NOT USE FOR PRODUCTION
- Title
- Size:
- Date:
- B
- Author:
- Time:
- Sheet
- Revision:
- of
- File:

### Library data of the parts
C1 C5-C7 = Varitron_CAP0402: C nF V TEMP TOL% 0402 (1005 Metric)  SMD; Case-EIA: 0402; Case-Metric: 1005; Tolerance: TOL; Value: C nF; Technology: SMT
C2 = Varitron_CAP0603: as C50 on sheet 1_PWR; Tolerance: 10%; Technology: SMT; Temperature Coefficient: X7R; Voltage Rating: 10V; Value: 1.0uF
C3 C43 C45 = Varitron_CAP0402: as C51 on sheet 1_PWR; Tolerance: 10%; Technology: SMT; Temperature Coefficient: X7R; Voltage Rating: 10V; Value: 100 nF
C4 = Varitron_CAP0402: 6.8 nF 6V X7R 5% 0402 (1005 Metric)  SMD; Case-EIA: 0402; Case-Metric: 1005; Tolerance: 5%; Technology: SMT; Temperature Coefficient: X7R; Voltage Rating: 6V; Value: 6.8 nF
C44 = Varitron_CAP0805: as C47 on sheet 1_PWR; Tolerance: 10%; Technology: SMT; Temperature Coefficient: X7R; Voltage Rating: 10V; Value: 10 uF
C46 = Varitron_CAP0402: 220 nF 10V X7R 10% 0402 (1005 Metric)  SMD; Case-EIA: 0402; Case-Metric: 1005; Tolerance: 10%; Technology: SMT; Temperature Coefficient: X7R; Voltage Rating: 10V; Value: 220 nF
J6 = 59453-061110ECHLF: Connector, FPC, 0.5 mm pitch, 6 contacts; Manufacturer: FCI; Manufacturer Part Number: 59453-061110ECHLF; Part Number: 59453-061110ECHLF
R1 = Varitron_RES0402: 2K 0.063W 5%  0402 (1005 Metric)  SMD; Case-Metric: 1005; Case-EIA: 0402; Tolerance: 5%; Technology: SMT; Power: 0.063W; Value: 2k Ohm
SB1 = SOLDERBRIDGE_SHORTED: Shorted Solderbridge; Value: Solderbridge
TP1-TP5 TP117 TP133 TP134 TP139 TP144 = TESTPAD_TH_35mils: as TP8 on sheet 1_PWR
TP118 = TESTPAD_TH_1_5MM: as TP18 on sheet 1_PWR
U1 = AT42QT1010: One-channel Touch Sensor IC with Reset Timer, -40° to +85° C, 6-pin SOT23; Manufacturer: Atmel; Manufacturer Part Number: AT42QT1010; Part Number: AT42QT1010; Supplier: Arrow Electronics; Footprint Name: SOT23-6
U11 = LSM303AGR: IC 3D Accelerometer and 3D Magnetometer, LGA-12, 2 x 2 x 1 mm; Manufacturer: STMicroelectronics; Manufacturer Part Number: LSM303AGR

## Sheet 5_MISC.SchDoc: SmartHalo - Misc
size B; Author: Sébastien Gélinas; Organization: SmartHalo; Address1: 5445 de Gaspé; Address2: Montréal, QC; Address3: Canada; Address4: H2T 3B2; Revision: 1; SheetNumber: 5; SheetTotal: 7
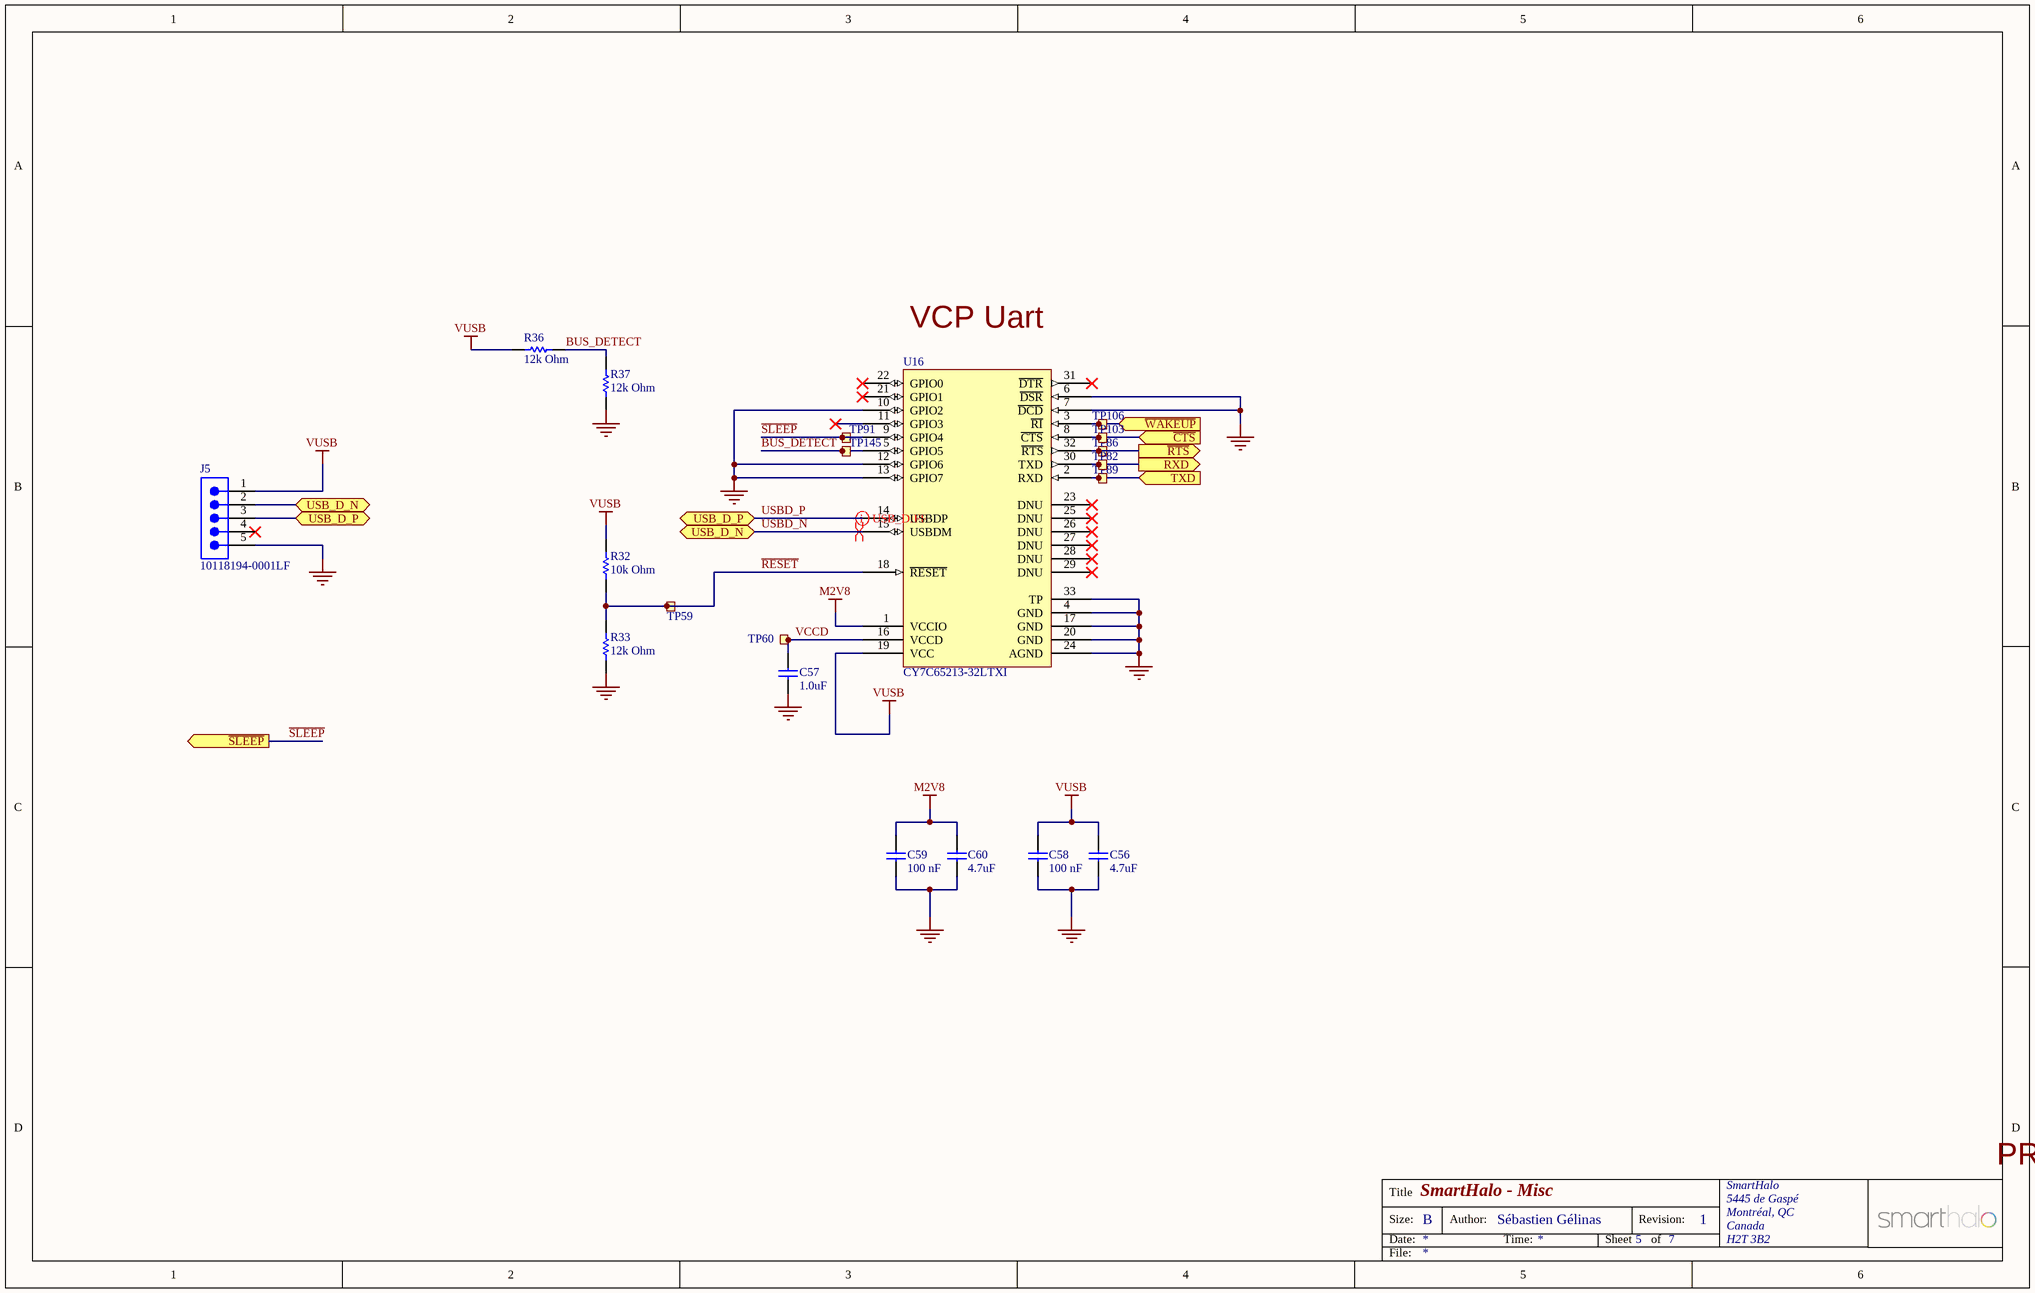
[diagram p5: 5_MISC.SchDoc]

### Parts
C56  4.7uF  [Varitron_CAP0603]
C57  1.0uF  [Varitron_CAP0603]
C58  100 nF  [Varitron_CAP0402]
C59  100 nF  [Varitron_CAP0402]
C60  4.7uF  [Varitron_CAP0603]
J5  10118194-0001LF  [10118194-0001LF]
R32  10k Ohm  [Varitron_RES0402]
R33  12k Ohm  [Varitron_RES0402]
R36  12k Ohm  [Varitron_RES0402]
R37  12k Ohm  [Varitron_RES0402]
TP59  (no value)  [TESTPAD-TH-35mils]  (no BOM)
TP60  (no value)  [TESTPAD-TH-35mils]  (no BOM)
TP82  (no value)  [TESTPAD-TH-35mils]  (no BOM)
TP86  (no value)  [TESTPAD-TH-35mils]  (no BOM)
TP89  (no value)  [TESTPAD-TH-35mils]  (no BOM)
TP91  (no value)  [TESTPAD-TH-35mils]  (no BOM)
TP103  (no value)  [TESTPAD-TH-35mils]  (no BOM)
TP106  (no value)  [TESTPAD-TH-35mils]  (no BOM)
TP145  TP  [TESTPAD-TH-35mils]  (value not drawn)  (no BOM)
U16  CY7C65213-32LTXI  [QFN-32-TP]

### Ports
RXD (out), TXD (in), USB_D_N (bidir), USB_D_P (bidir), ~{CTS} (in), ~{RTS} (out), ~{SLEEP} (out), ~{WAKEUP} (in)

### Nets
GND: C56.2 C57.2 C58.2 C59.2 C60.2 J5.0(ASSY) J5.5 R33.1 R37.2 U16.4(GND) U16.6(~{DSR}) U16.7(~{DCD}) U16.10(GPIO2) U16.12(GPIO6) U16.13(GPIO7) U16.17(GND) U16.20(GND) U16.24(AGND) U16.33(TP)
M2V8: C59.1 C60.1 U16.1(VCCIO)  [project net VDD_nRF]
VUSB: C56.1 C58.1 J5.1 R32.2 R36.2 U16.19(VCC)
BUS_DETECT: R36.1 R37.1 TP145.1 U16.5(GPIO5)
CTS: TP103.1 U16.8(~{CTS}) ; port ~{CTS}
~{RESET}: R32.1 R33.2 TP59.1 U16.18(~{RESET})
RTS: TP86.1 U16.32(~{RTS}) ; port ~{RTS}
RXD: TP82.1 U16.30(TXD) ; port RXD
~{SLEEP}: TP91.1 U16.9(GPIO4) ; port ~{SLEEP}
TXD: TP89.1 U16.2(RXD) ; port TXD
USBD_N: J5.2 U16.15(USBDM) ; port USB_D_N
USBD_P: J5.3 U16.14(USBDP) ; port USB_D_P
VCCD: C57.1 TP60.1 U16.16(VCCD)
~{WAKEUP}: TP106.1 U16.3(~{RI}) ; port ~{WAKEUP}

Not connected (* = marked no-connect by the designer): J5 4*; U16 11(GPIO3)* 21(GPIO1)* 22(GPIO0)* 23(DNU)* 25(DNU)* 26(DNU)* 27(DNU)* 28(DNU)* 29(DNU)* 31(~{DTR})*

### Layout directives
differential pair: USBD_N, USBD_P

### Notes on the sheet
- (near U16) VCP Uart
- PRELIMINARY: DO NOT USE FOR PRODUCTION
- Title
- Size:
- Date:
- B
- Author:
- Time:
- Sheet
- Revision:
- of
- File:

### Library data of the parts
C56 C60 = Varitron_CAP0603: as C23 on sheet 1_PWR; Tolerance: 10%; Technology: SMT; Temperature Coefficient: X7R; Voltage Rating: 10V; Value: 4.7uF
C57 = Varitron_CAP0603: as C50 on sheet 1_PWR; Tolerance: 10%; Technology: SMT; Temperature Coefficient: X7R; Voltage Rating: 10V; Value: 1.0uF
C58 C59 = Varitron_CAP0402: as C51 on sheet 1_PWR; Tolerance: 10%; Technology: SMT; Temperature Coefficient: X7R; Voltage Rating: 10V; Value: 100 nF
J5 = 10118194-0001LF: Micro USB B Type Receptacle; Manufacturer: Amphenol FCI; Manufacturer Part Number: 10118194-0001LF; Part Number: 10118194-0001LF
R32 = Varitron_RES0402: as R19 on sheet 1_PWR; Tolerance: 5%; Technology: SMT; Power: 0.063W; Value: 10k Ohm
R33 R36 R37 = Varitron_RES0402: 12K 0.063W 5% 0402 (1005 Metric)  SMD; Case-Metric: 1005; Case-EIA: 0402; Tolerance: 5%; Technology: SMT; Power: 0.063W; Value: 12k Ohm
TP59 TP60 TP82 TP86 TP89 TP91 TP103 TP106 = TESTPAD_TH_35mils: as TP8 on sheet 1_PWR
TP145 = TESTPAD_TH_35mils: Testpoint, through hole, 35 mils; Value: TP
U16 = CY7C65213-32LTXI: IC USB TO UART BRIDGE 32QFN; Manufacturer: Cypress; Manufacturer Part Number: CY7C65213-32LTXI; Part Number: CY7C65213-32LTXI

## Sheet 6_ALARM.SchDoc: Alarm and sound
size B; Author: Sebastien Gelinas; CompanyName: SmartHalo; Organization: SmartHalo; Address1: 5445 de Gaspé; Address2: Montréal, QC; Address3: Canada; Address4: H2T 3B2; Revision: 1; SheetNumber: 6; SheetTotal: 7
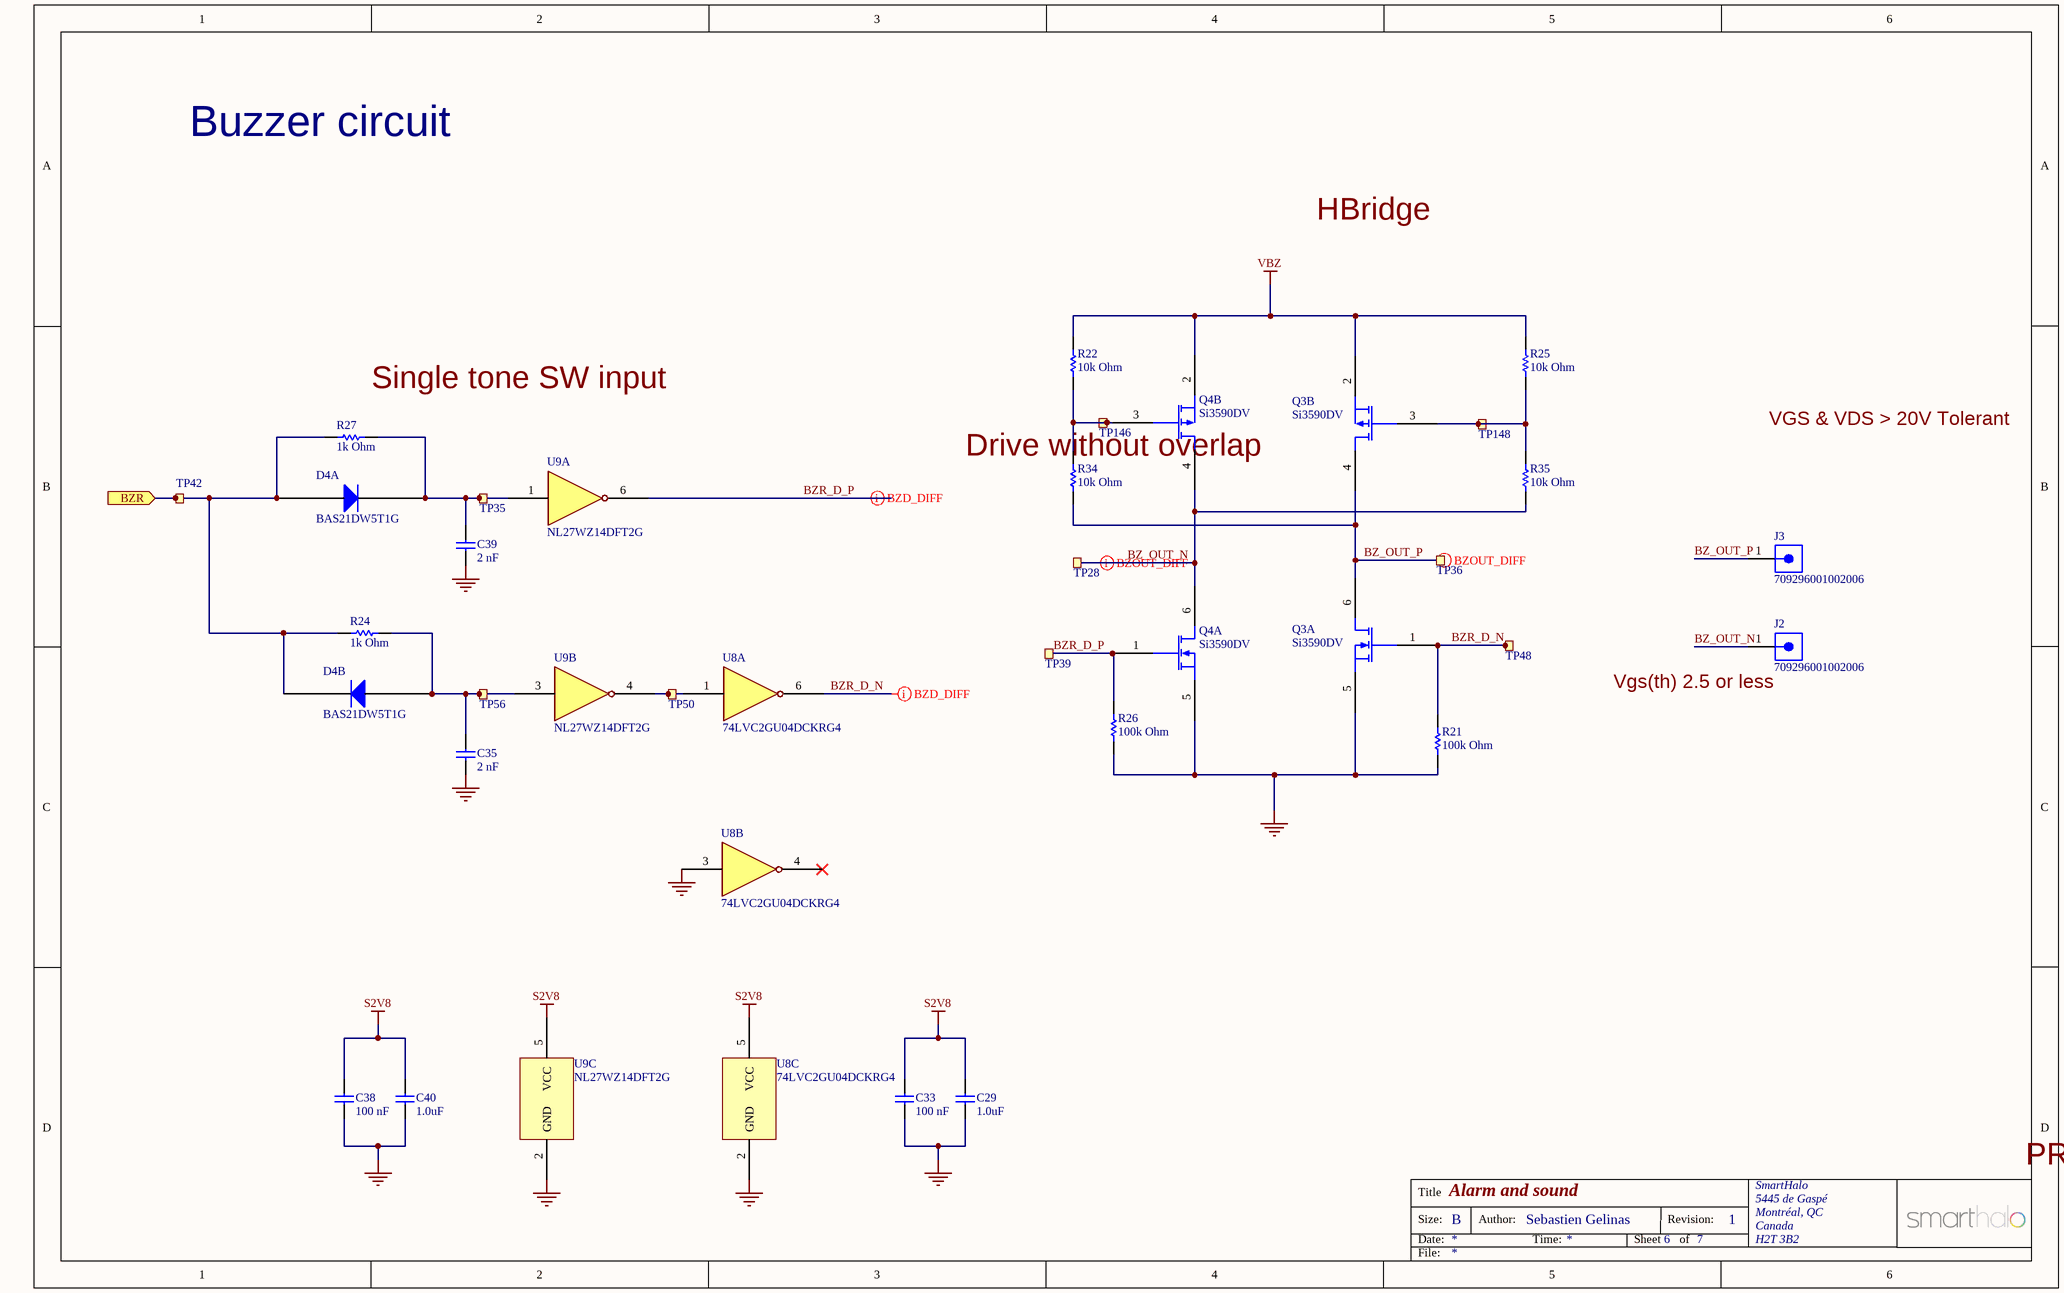
[diagram p6: 6_ALARM.SchDoc]

### Parts
C29  1.0uF  [Varitron_CAP0603]
C33  100 nF  [Varitron_CAP0402]
C35  2 nF  [Varitron_CAP0402]
C38  100 nF  [Varitron_CAP0402]
C39  2 nF  [Varitron_CAP0402]
C40  1.0uF  [Varitron_CAP0603]
D4  BAS21DW5T1G  [SC70-5]  (parts A,B of 2)
J2  709296001002006  [709296001002006]
J3  709296001002006  [709296001002006]
Q3  Si3590DV  [TSOP-6]  (parts A,B of 2)
Q4  Si3590DV  [TSOP-6]  (parts A,B of 2)
R21  100k Ohm  [Varitron_RES0402]
R22  10k Ohm  [Varitron_RES0402]
R24  1k Ohm  [Varitron_RES0402]
R25  10k Ohm  [Varitron_RES0402]
R26  100k Ohm  [Varitron_RES0402]
R27  1k Ohm  [Varitron_RES0402]
R34  10k Ohm  [Varitron_RES0402]
R35  10k Ohm  [Varitron_RES0402]
TP28  (no value)  [TESTPAD-TH-1_5mm]  (no BOM)
TP35  (no value)  [TESTPAD-TH-35mils]  (no BOM)
TP36  (no value)  [TESTPAD-TH-1_5mm]  (no BOM)
TP39  (no value)  [TESTPAD-TH-35mils]  (no BOM)
TP42  (no value)  [TESTPAD-TH-35mils]  (no BOM)
TP48  (no value)  [TESTPAD-TH-35mils]  (no BOM)
TP50  (no value)  [TESTPAD-TH-35mils]  (no BOM)
TP56  (no value)  [TESTPAD-TH-35mils]  (no BOM)
TP146  TP  [TESTPAD-TH-35mils]  (value not drawn)  (no BOM)
TP148  TP  [TESTPAD-TH-35mils]  (value not drawn)  (no BOM)
U8  74LVC2GU04DCKRG4  [SOT363_SC70_6]  (parts A,B,C of 3)
U9  NL27WZ14DFT2G  [SOT363_SC70_6]  (parts A,B,C of 3)

### Ports
BZR (in)

### Nets
GND: C29.2 C33.2 C35.2 C38.2 C39.2 C40.2 Q3.5(S1) Q4.5(S1) R21.1 R26.1 U8.2(GND) U8.3 U9.2(GND)
S2V8: C29.1 C33.1 C38.1 C40.1 U8.5(VCC) U9.5(VCC)
VBZ: Q3.2(S2) Q4.2(S2) R22.2 R25.2
BZ_OUT_N: J2.1 Q4.4(D2) Q4.6(D1) R35.1 TP28.1
BZ_OUT_P: J3.1 Q3.4(D2) Q3.6(D1) R34.1 TP36.1
BZR: D4.1(Anode) D4.4(Cathode) R24.2 R27.2 TP42.1 ; port BZR
BZR_D_N: Q3.1(G1) R21.2 TP48.1 U8.6
BZR_D_P: Q4.1(G1) R26.2 TP39.1 U9.6
NetC35_1: C35.1 D4.3(Anode) R24.1 TP56.1 U9.3
NetC39_1: C39.1 D4.5(Cathode) R27.1 TP35.1 U9.1
NetQ3_3: Q3.3(G2) R25.1 R35.2 TP148.1
NetQ4_3: Q4.3(G2) R22.1 R34.2 TP146.1
NetTP50_1: TP50.1 U8.1 U9.4

Not connected (* = marked no-connect by the designer): D4 2; U8 4*

### Layout directives
differential pair: BZ_OUT_N, BZ_OUT_P, BZR_D_N, BZR_D_P

### Notes on the sheet
- Buzzer circuit
- HBridge
- (near R27) Single tone SW input
- VGS & VDS > 20V Tolerant
- (near U9) Drive without overlap
- Vgs(th) 2.5 or less
- PRELIMINARY: DO NOT USE FOR PRODUCTION
- Title
- Size:
- Date:
- B
- Author:
- Time:
- Sheet
- Revision:
- of
- File:

### Library data of the parts
C29 C40 = Varitron_CAP0603: as C50 on sheet 1_PWR; Tolerance: 10%; Technology: SMT; Temperature Coefficient: X7R; Voltage Rating: 10V; Value: 1.0uF
C33 C38 = Varitron_CAP0402: as C51 on sheet 1_PWR; Tolerance: 10%; Technology: SMT; Temperature Coefficient: X7R; Voltage Rating: 10V; Value: 100 nF
C35 C39 = Varitron_CAP0402: 2 nF 6V X5R 10% 0402 (1005 Metric)  SMD; Case-EIA: 0402; Case-Metric: 1005; Tolerance: 10%; Technology: SMT; Temperature Coefficient: X5R; Voltage Rating: 6V; Value: 2 nF
D4 = BAS21DW5T1G: High Voltage Switching Diode; Manufacturer: ON Semiconductor; Manufacturer Part Number: BAS21DW5T1G; Part Number: BAS21DW5T1G
J2 J3 = 709296001002006: Connector, Single Horizontal Contact, 2 x 2 mm; Manufacturer: AVX; Manufacturer Part Number: 709296001002006; Part Number: 709296001002006
Q3 Q4 = Si3590DV: N and P Channel 30 V MOSFET; Manufacturer: Vishay; Manufacturer Part Number: Si3590DV; Part Number: Si3590DV
R21 R26 = Varitron_RES0402: as R4 on sheet 2_BLE; Tolerance: 5%; Technology: SMT; Power: 0.063W; Value: 100k Ohm
R22 R25 R34 R35 = Varitron_RES0402: as R19 on sheet 1_PWR; Tolerance: 5%; Technology: SMT; Power: 0.063W; Value: 10k Ohm
R24 R27 = Varitron_RES0402: as R9 on sheet 1_PWR; Tolerance: 5%; Technology: SMT; Power: 0.063W; Value: 1k Ohm
TP28 TP36 = TESTPAD_TH_1_5MM: as TP18 on sheet 1_PWR
TP35 TP39 TP42 TP48 TP50 TP56 = TESTPAD_TH_35mils: as TP8 on sheet 1_PWR
TP146 TP148 = TESTPAD_TH_35mils: Testpoint, through hole, 35 mils; Value: TP
U8 = 74LVC2GU04DCKRG4: Dual Inverter Gate; Manufacturer: Texas Instruments; Manufacturer Part Number: 74LVC2GU04DCKRG4; Part Number: 74LVC2GU04DCKRG4
U9 = NL27WZ14DFT2G: IC Dual Inverter with Schmitt Trigger Inputs; Manufacturer: ON Semiconductor; Manufacturer Part Number: NL27WZ14DFT2G; Part Number: NL27WZ14DFT2G